# EAGLE design xmosio2 (EAGLE 7.6.0)

## Sheet 1 of 5: BUS i/o
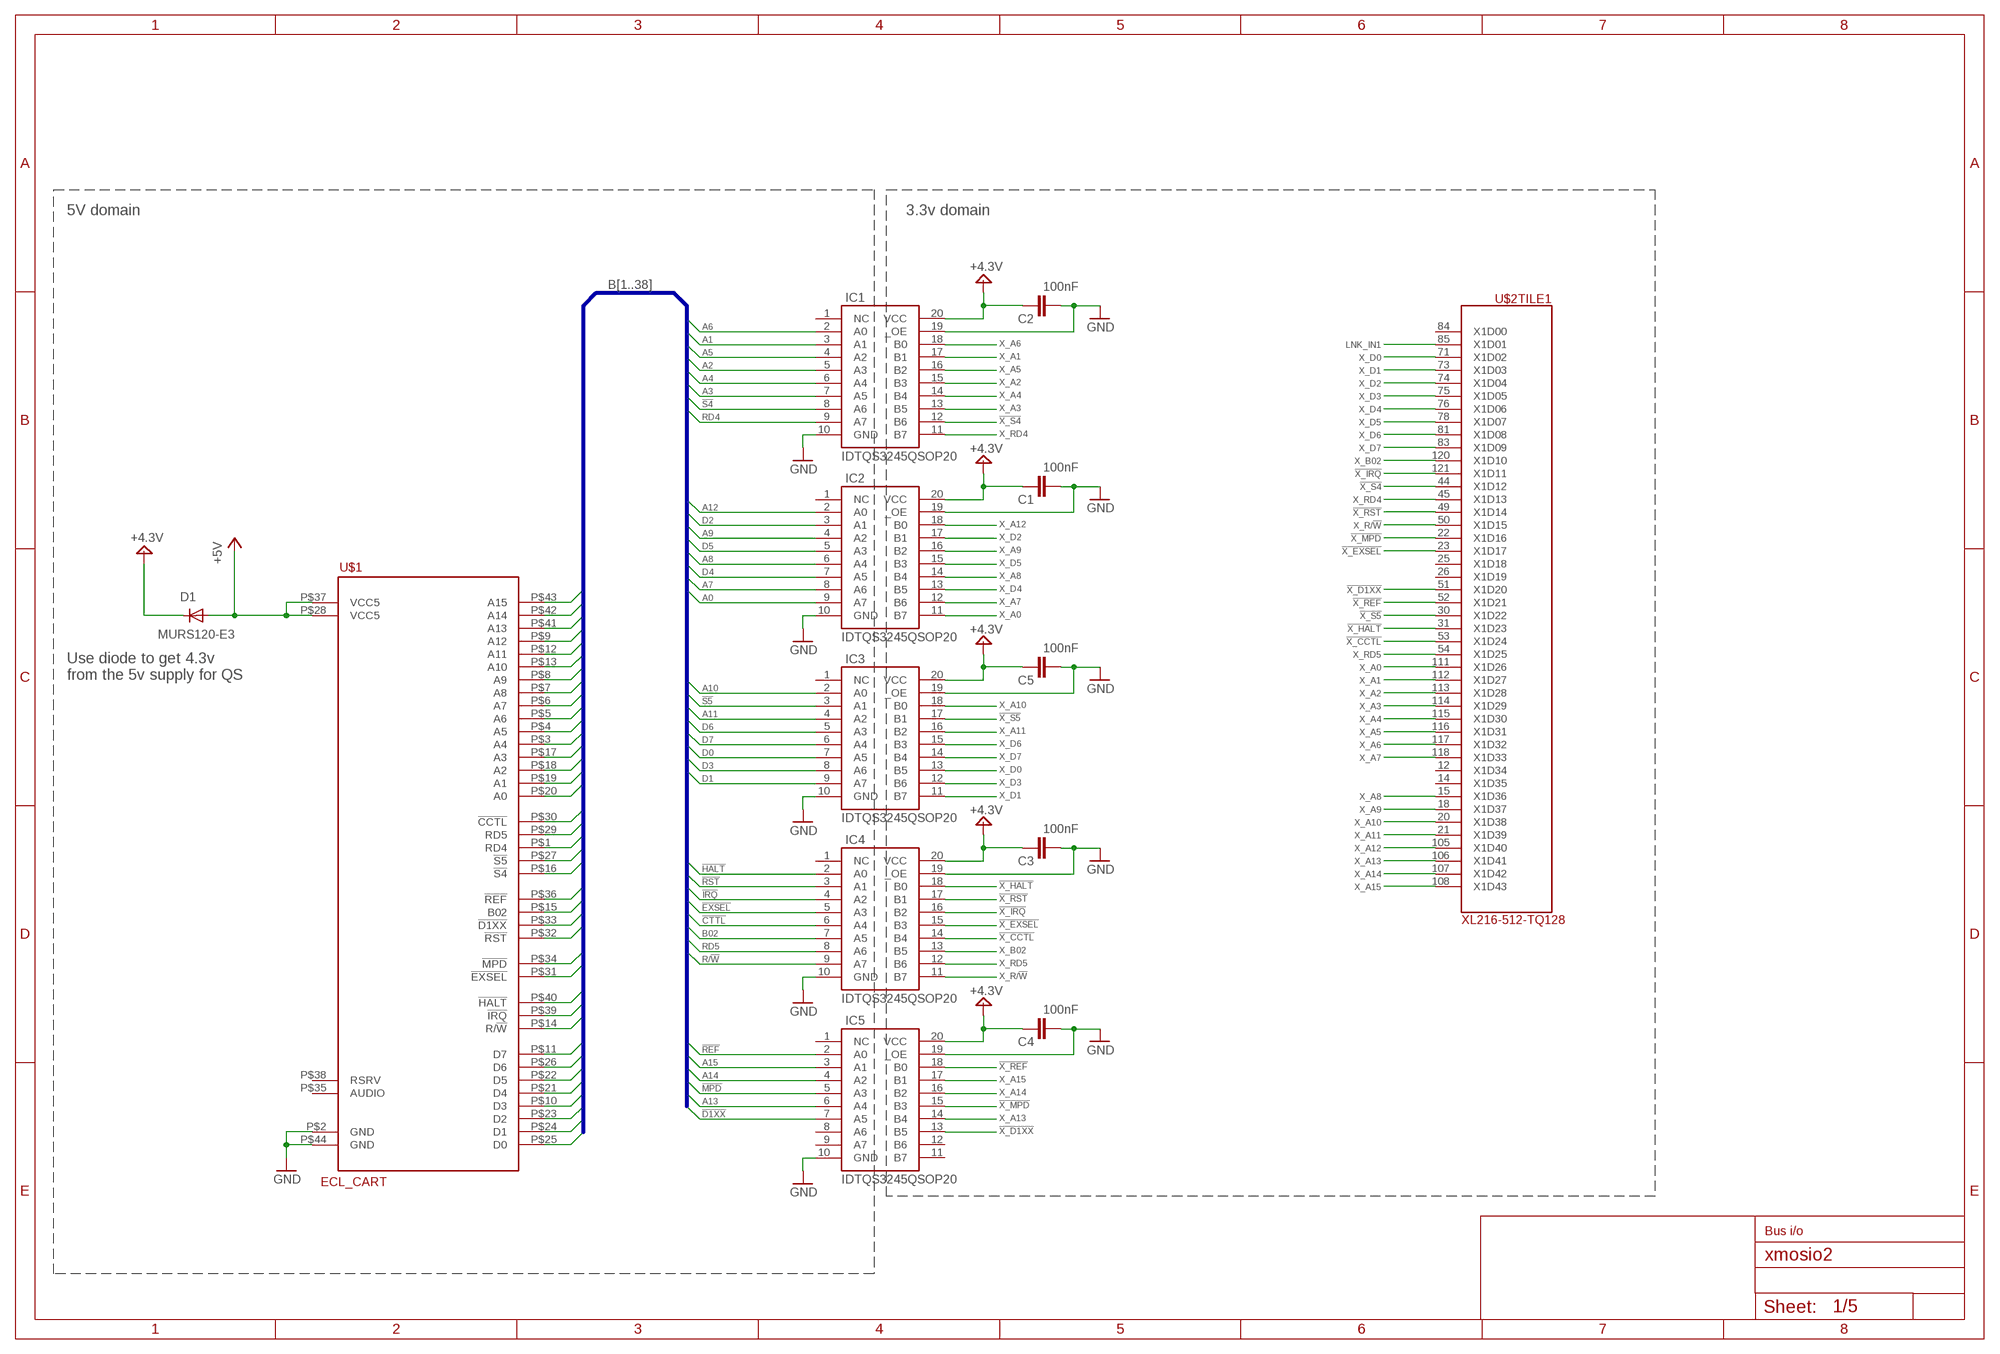
[diagram p0: schematic, sheet 1]

### Parts
C1  100nF  C-EUC0603  [C0603]
C2  100nF  C-EUC0603  [C0603]
C3  100nF  C-EUC0603  [C0603]
C4  100nF  C-EUC0603  [C0603]
C5  100nF  C-EUC0603  [C0603]
D1  MURS120-E3  DIODE-SMB  [SMB]
IC1  IDTQS3245QSOP20  [QSOP20]
IC2  IDTQS3245QSOP20  [QSOP20]
IC3  IDTQS3245QSOP20  [QSOP20]
IC4  IDTQS3245QSOP20  [QSOP20]
IC5  IDTQS3245QSOP20  [QSOP20]
U$1  ECL_CART  [ECL_CART]
U$2  XL216-512-TQ128  [TQFP128]

### Nets
!X_CCTL!: IC4.14(B4) U$2.53(TILE1:X1D24)
!X_D1XX!: IC5.13(B5) U$2.51(TILE1:X1D20)
!X_EXSEL!: IC4.15(B3) U$2.23(TILE1:X1D17)
!X_HALT!: IC4.18(B0) U$2.31(TILE1:X1D23)
!X_IRQ!: IC4.16(B2) U$2.121(TILE1:X1D11)
!X_MPD!: IC5.15(B3) U$2.22(TILE1:X1D16)
!X_REF!: IC5.18(B0) U$2.52(TILE1:X1D21)
!X_RST!: IC4.17(B1) U$2.49(TILE1:X1D14)
!X_S4!: IC1.12(B6) U$2.44(TILE1:X1D12)
!X_S5!: IC3.17(B1) U$2.30(TILE1:X1D22)
+4.3V: C1.1 C2.1 C3.1 C4.1 C5.1 D1.C IC1.20(VCC) IC2.20(VCC) IC3.20(VCC) IC4.20(VCC) IC5.20(VCC)
+5V [Power]: D1.A U$1.P$28(VCC5) U$1.P$37(VCC5) ; also sheet 2
B1: IC1.9(A7) U$1.P$1(RD4)
B2: IC1.8(A6) U$1.P$16(!S4!)
B3: IC1.7(A5) U$1.P$17(A3)
B4: IC1.6(A4) U$1.P$3(A4)
B5: IC1.5(A3) U$1.P$18(A2)
B6: IC1.4(A2) U$1.P$4(A5)
B7: IC1.3(A1) U$1.P$19(A1)
B8: IC1.2(A0) U$1.P$5(A6)
B9: IC2.9(A7) U$1.P$20(A0)
B10: IC2.8(A6) U$1.P$6(A7)
B11: IC2.7(A5) U$1.P$21(D4)
B12: IC2.6(A4) U$1.P$7(A8)
B13: IC2.5(A3) U$1.P$22(D5)
B14: IC2.4(A2) U$1.P$8(A9)
B15: IC2.3(A1) U$1.P$23(D2)
B16: IC2.2(A0) U$1.P$9(A12)
B17: IC3.9(A7) U$1.P$24(D1)
B18: IC3.8(A6) U$1.P$10(D3)
B19: IC3.7(A5) U$1.P$25(D0)
B20: IC3.6(A4) U$1.P$11(D7)
B21: IC3.5(A3) U$1.P$26(D6)
B22: IC3.4(A2) U$1.P$12(A11)
B23: IC3.3(A1) U$1.P$27(!S5!)
B24: IC3.2(A0) U$1.P$13(A10)
B25: IC4.9(A7) U$1.P$14(R/!W!)
B26: IC4.8(A6) U$1.P$29(RD5)
B27: IC4.7(A5) U$1.P$15(B02)
B28: IC4.6(A4) U$1.P$30(!CCTL!)
B29: IC4.5(A3) U$1.P$31(!EXSEL!)
B30: IC4.4(A2) U$1.P$39(!IRQ!)
B31: IC4.3(A1) U$1.P$32(!RST!)
B32: IC4.2(A0) U$1.P$40(!HALT!)
B33: IC5.7(A5) U$1.P$33(!D1XX!)
B34: IC5.6(A4) U$1.P$41(A13)
B35: IC5.5(A3) U$1.P$34(!MPD!)
B36: IC5.4(A2) U$1.P$42(A14)
B37: IC5.3(A1) U$1.P$43(A15)
B38: IC5.2(A0) U$1.P$36(!REF!)
GND: C1.2 C2.2 C3.2 C4.2 C5.2 IC1.10(GND) IC1.19(_OE) IC2.10(GND) IC2.19(_OE) IC3.10(GND) IC3.19(_OE) IC4.10(GND) IC4.19(_OE) IC5.10(GND) IC5.19(_OE) U$1.P$2(GND) U$1.P$44(GND) ; also sheet 2,3,4,5
LNK_IN1: U$2.85(TILE1:X1D01) ; also sheet 5
X_A0: IC2.11(B7) U$2.111(TILE1:X1D26)
X_A1: IC1.17(B1) U$2.112(TILE1:X1D27)
X_A2: IC1.15(B3) U$2.113(TILE1:X1D28)
X_A3: IC1.13(B5) U$2.114(TILE1:X1D29)
X_A4: IC1.14(B4) U$2.115(TILE1:X1D30)
X_A5: IC1.16(B2) U$2.116(TILE1:X1D31)
X_A6: IC1.18(B0) U$2.117(TILE1:X1D32)
X_A7: IC2.12(B6) U$2.118(TILE1:X1D33)
X_A8: IC2.14(B4) U$2.15(TILE1:X1D36)
X_A9: IC2.16(B2) U$2.18(TILE1:X1D37)
X_A10: IC3.18(B0) U$2.20(TILE1:X1D38)
X_A11: IC3.16(B2) U$2.21(TILE1:X1D39)
X_A12: IC2.18(B0) U$2.105(TILE1:X1D40)
X_A13: IC5.14(B4) U$2.106(TILE1:X1D41)
X_A14: IC5.16(B2) U$2.107(TILE1:X1D42)
X_A15: IC5.17(B1) U$2.108(TILE1:X1D43)
X_B02: IC4.13(B5) U$2.120(TILE1:X1D10)
X_D0: IC3.13(B5) U$2.71(TILE1:X1D02)
X_D1: IC3.11(B7) U$2.73(TILE1:X1D03)
X_D2: IC2.17(B1) U$2.74(TILE1:X1D04)
X_D3: IC3.12(B6) U$2.75(TILE1:X1D05)
X_D4: IC2.13(B5) U$2.76(TILE1:X1D06)
X_D5: IC2.15(B3) U$2.78(TILE1:X1D07)
X_D6: IC3.15(B3) U$2.81(TILE1:X1D08)
X_D7: IC3.14(B4) U$2.83(TILE1:X1D09)
X_R/!W!: IC4.11(B7) U$2.50(TILE1:X1D15)
X_RD4: IC1.11(B7) U$2.45(TILE1:X1D13)
X_RD5: IC4.12(B6) U$2.54(TILE1:X1D25)
Unconnected: IC1.1(NC) IC2.1(NC) IC3.1(NC) IC4.1(NC) IC5.1(NC) IC5.8(A6) IC5.9(A7) IC5.11(B7) IC5.12(B6) U$1.P$35(AUDIO) U$1.P$38(RSRV) U$2.12(TILE1:X1D34) U$2.14(TILE1:X1D35) U$2.25(TILE1:X1D18) U$2.26(TILE1:X1D19) U$2.84(TILE1:X1D00)

### Buses
B[1..38]

### Notes on the sheet
- 5V domain | 3.3v domain
- A6
- A1
- A5
- A2
- A4
- A3
- !S4!
- RD4
- A12
- D2
- A9
- D5
- A8
- D4
- A7
- A0
- Use diode to get 4.3v
  from the 5v supply for QS
- A10
- !S5!
- A11
- D6
- D7
- D0
- D3
- D1
- !HALT!
- !RST!
- !IRQ!
- !EXSEL!
- !CTTL!
- B02
- RD5
- R/!W!
- !REF!
- A15
- A14
- !MPD!
- A13
- !D1XX!
- Bus i/o

## Sheet 2 of 5: Power
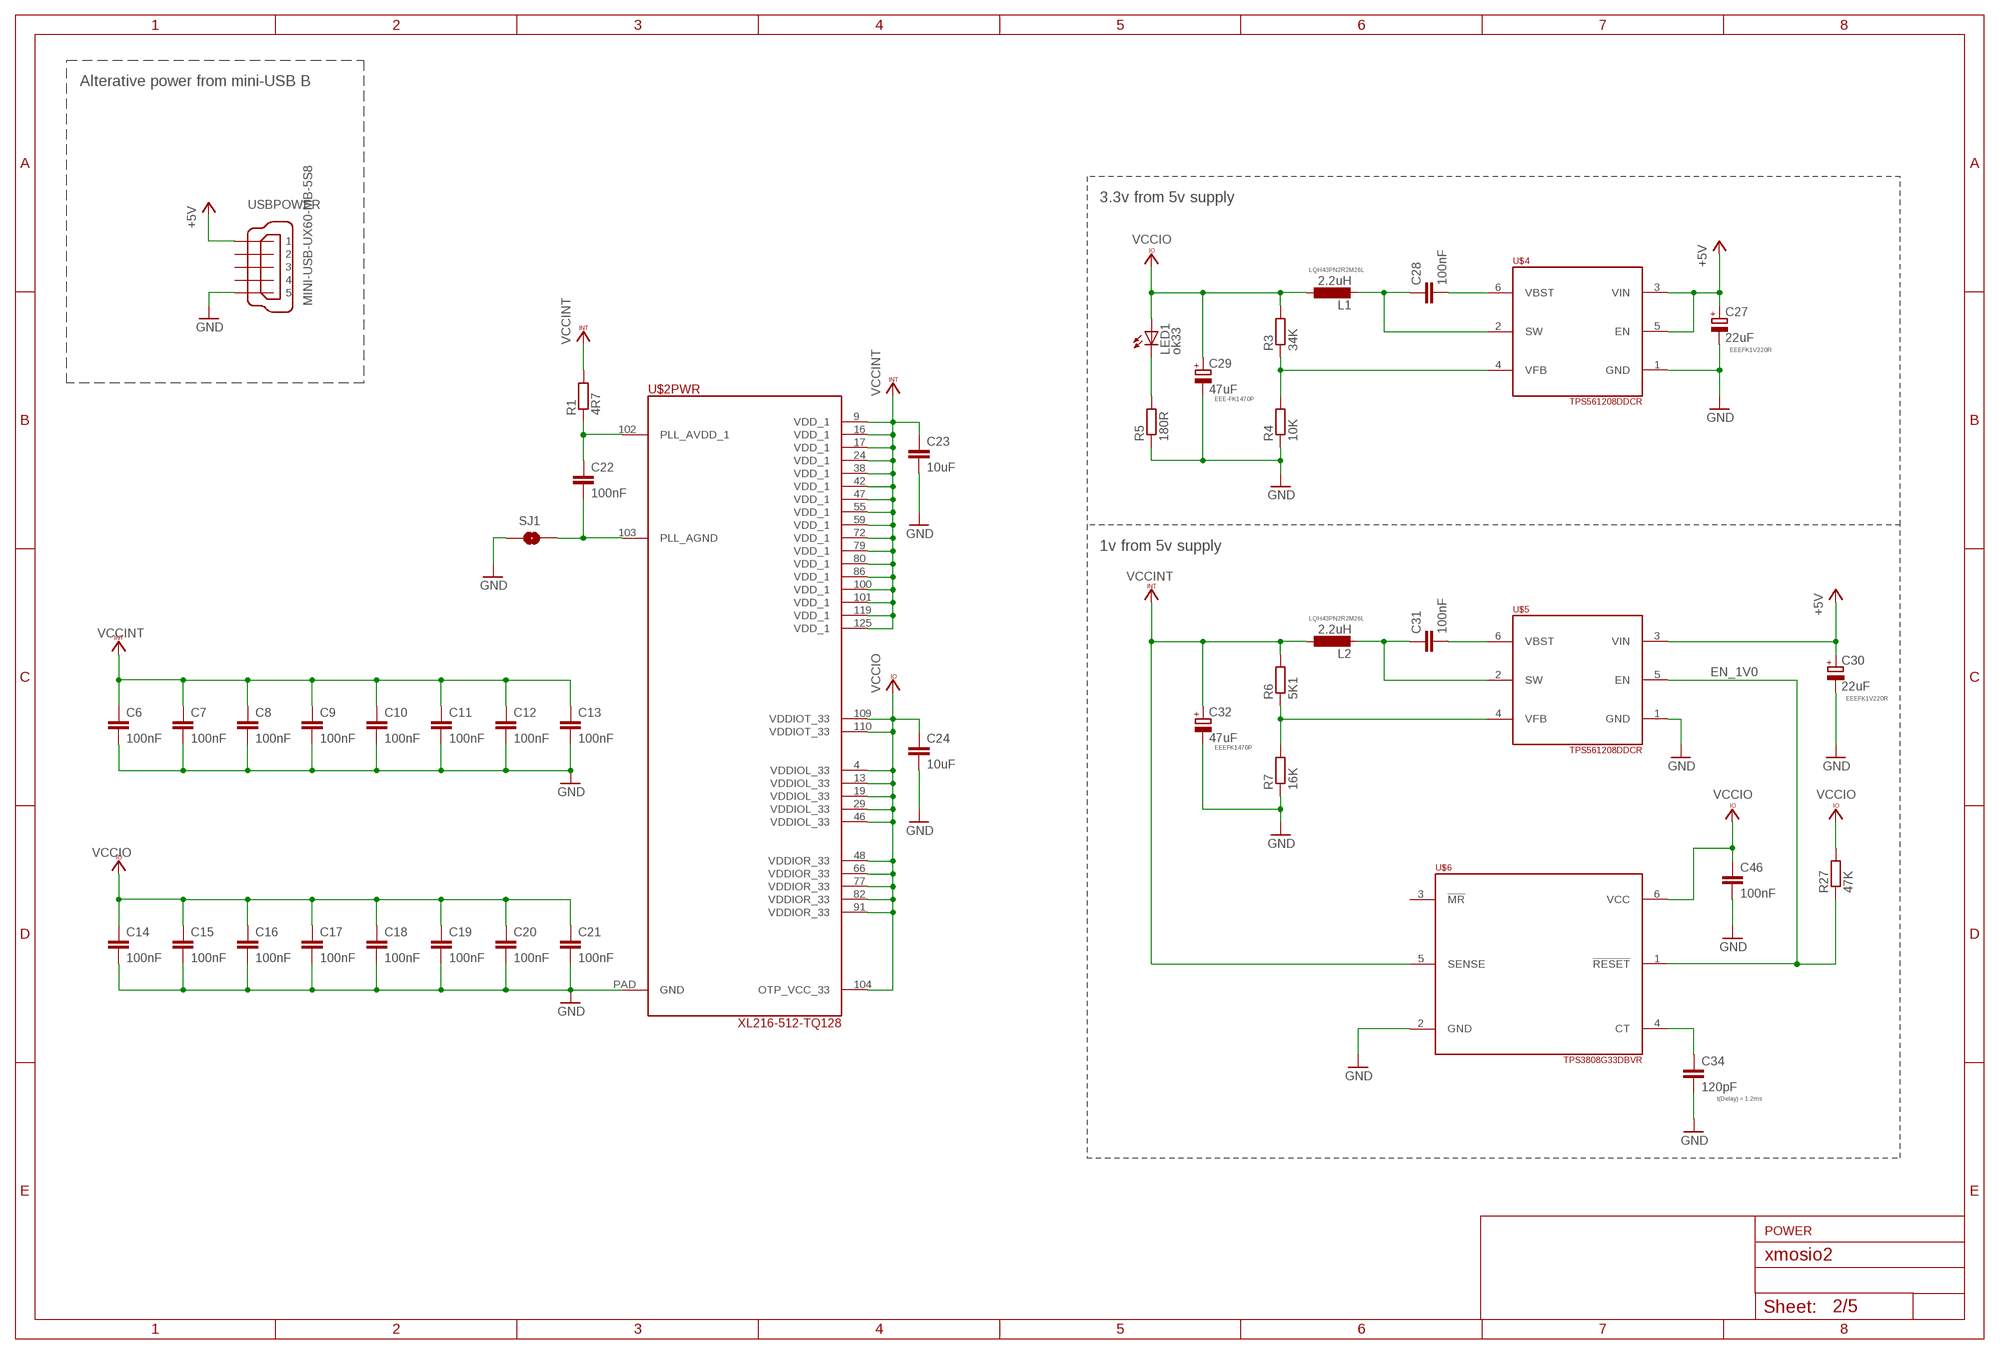
[diagram p1: schematic, sheet 2]

### Parts
C6  100nF  C-EUC0603  [C0603]
C7  100nF  C-EUC0603  [C0603]
C8  100nF  C-EUC0603  [C0603]
C9  100nF  C-EUC0603  [C0603]
C10  100nF  C-EUC0603  [C0603]
C11  100nF  C-EUC0603  [C0603]
C12  100nF  C-EUC0603  [C0603]
C13  100nF  C-EUC0603  [C0603]
C14  100nF  C-EUC0603  [C0603]
C15  100nF  C-EUC0603  [C0603]
C16  100nF  C-EUC0603  [C0603]
C17  100nF  C-EUC0603  [C0603]
C18  100nF  C-EUC0603  [C0603]
C19  100nF  C-EUC0603  [C0603]
C20  100nF  C-EUC0603  [C0603]
C21  100nF  C-EUC0603  [C0603]
C22  100nF  C-EUC0603  [C0603]
C23  10uF  C-EUC0603  [C0603]
C24  10uF  C-EUC0603  [C0603]
C27  22uF  CPOL-EUC  [PANASONIC_C]
C28  100nF  C-EUC0603  [C0603]
C29  47uF  CPOL-EUD  [PANASONIC_D]
C30  22uF  CPOL-EUC  [PANASONIC_C]
C31  100nF  C-EUC0603  [C0603]
C32  47uF  CPOL-EUD  [PANASONIC_D]
C34  120pF  C-EUC0603  [C0603]
C46  100nF  C-EUC0603  [C0603]
L1  2.2uH  L-EUL1812  [L1812]
L2  2.2uH  L-EUL1812  [L1812]
LED1  ok33  LEDCHIP-LED0805  [CHIP-LED0805]
R1  4R7  R-EU_R0603  [R0603]
R3  34K  R-EU_R0603  [R0603]
R4  10K  R-EU_R0603  [R0603]
R5  180R  R-EU_R0603  [R0603]
R6  5K1  R-EU_R0603  [R0603]
R7  16K  R-EU_R0603  [R0603]
R27  47K  R-EU_R0603  [R0603]
SJ1  SOLDERJUMPERNC  [SJ_2S]
U$4  TPS561208DDCR  [TSOT23-6_DDC]
U$5  TPS561208DDCR  [TSOT23-6_DDC]
U$6  TPS3808G33DBVR  [SOT23-6]
USBPOWER  MINI-USB-UX60-MB-5S8  [UX60-MB-5S8]

### Nets
+5V [Power]: C27.+ C30.+ U$4.3(VIN) U$4.5(EN) U$5.3(VIN) USBPOWER.1 ; also sheet 1
EN_1V0 [Power]: R27.1 U$5.5(EN) U$6.1(!RESET!)
GND: C6.2 C7.2 C8.2 C9.2 C10.2 C11.2 C12.2 C13.2 C14.2 C15.2 C16.2 C17.2 C18.2 C19.2 C20.2 C21.2 C23.2 C24.2 C27.- C29.- C30.- C32.- C34.2 C46.2 R4.1 R5.1 R7.1 SJ1.1 U$2.PAD(PWR:GND) U$4.1(GND) U$5.1(GND) U$6.2(GND) USBPOWER.5 ; also sheet 1,3,4,5
N$1: C22.1 R1.1 U$2.102(PWR:PLL_AVDD_1)
N$3: C22.2 SJ1.2 U$2.103(PWR:PLL_AGND)
N$4: C28.2 U$4.6(VBST)
N$7 [Power]: C28.1 L1.2 U$4.2(SW)
N$8 [Power]: C31.2 U$5.6(VBST)
N$9 [Power]: R3.1 R4.2 U$4.4(VFB)
N$10: LED1.C R5.2
N$11 [Power]: C31.1 L2.2 U$5.2(SW)
N$12 [Power]: R6.1 R7.2 U$5.4(VFB)
N$13 [Power]: C34.1 U$6.4(CT)
VCCINT: C6.1 C7.1 C8.1 C9.1 C10.1 C11.1 C12.1 C13.1 C23.1 C32.+ L2.1 R1.2 R6.2 U$2.9(PWR:VDD_1) U$2.16(PWR:VDD_1) U$2.17(PWR:VDD_1) U$2.24(PWR:VDD_1) U$2.38(PWR:VDD_1) U$2.42(PWR:VDD_1) U$2.47(PWR:VDD_1) U$2.55(PWR:VDD_1) U$2.59(PWR:VDD_1) U$2.72(PWR:VDD_1) U$2.79(PWR:VDD_1) U$2.80(PWR:VDD_1) U$2.86(PWR:VDD_1) U$2.100(PWR:VDD_1) U$2.101(PWR:VDD_1) U$2.119(PWR:VDD_1) U$2.125(PWR:VDD_1) U$6.5(SENSE) ; also sheet 4
VCCIO: C14.1 C15.1 C16.1 C17.1 C18.1 C19.1 C20.1 C21.1 C24.1 C29.+ C46.1 L1.1 LED1.A R3.2 R27.2 U$2.4(PWR:VDDIOL_33) U$2.13(PWR:VDDIOL_33) U$2.19(PWR:VDDIOL_33) U$2.29(PWR:VDDIOL_33) U$2.46(PWR:VDDIOL_33) U$2.48(PWR:VDDIOR_33) U$2.66(PWR:VDDIOR_33) U$2.77(PWR:VDDIOR_33) U$2.82(PWR:VDDIOR_33) U$2.91(PWR:VDDIOR_33) U$2.104(PWR:OTP_VCC_33) U$2.109(PWR:VDDIOT_33) U$2.110(PWR:VDDIOT_33) U$6.6(VCC) ; also sheet 3,4,5
Unconnected: U$6.3(!MR!) USBPOWER.2 USBPOWER.3 USBPOWER.4

### Notes on the sheet
- Alterative power from mini-USB B
- 3.3v from 5v supply
- LQH43PN2R2M26L
- EEEFK1V220R
- EEE-FK1470P
- 1v from 5v supply
- LQH43PN2R2M26L
- EEEFK1V220R
- EEEFK1470P
- t(Delay) = 1.2ms
- POWER

## Sheet 3 of 5: SDRAM / QSPI
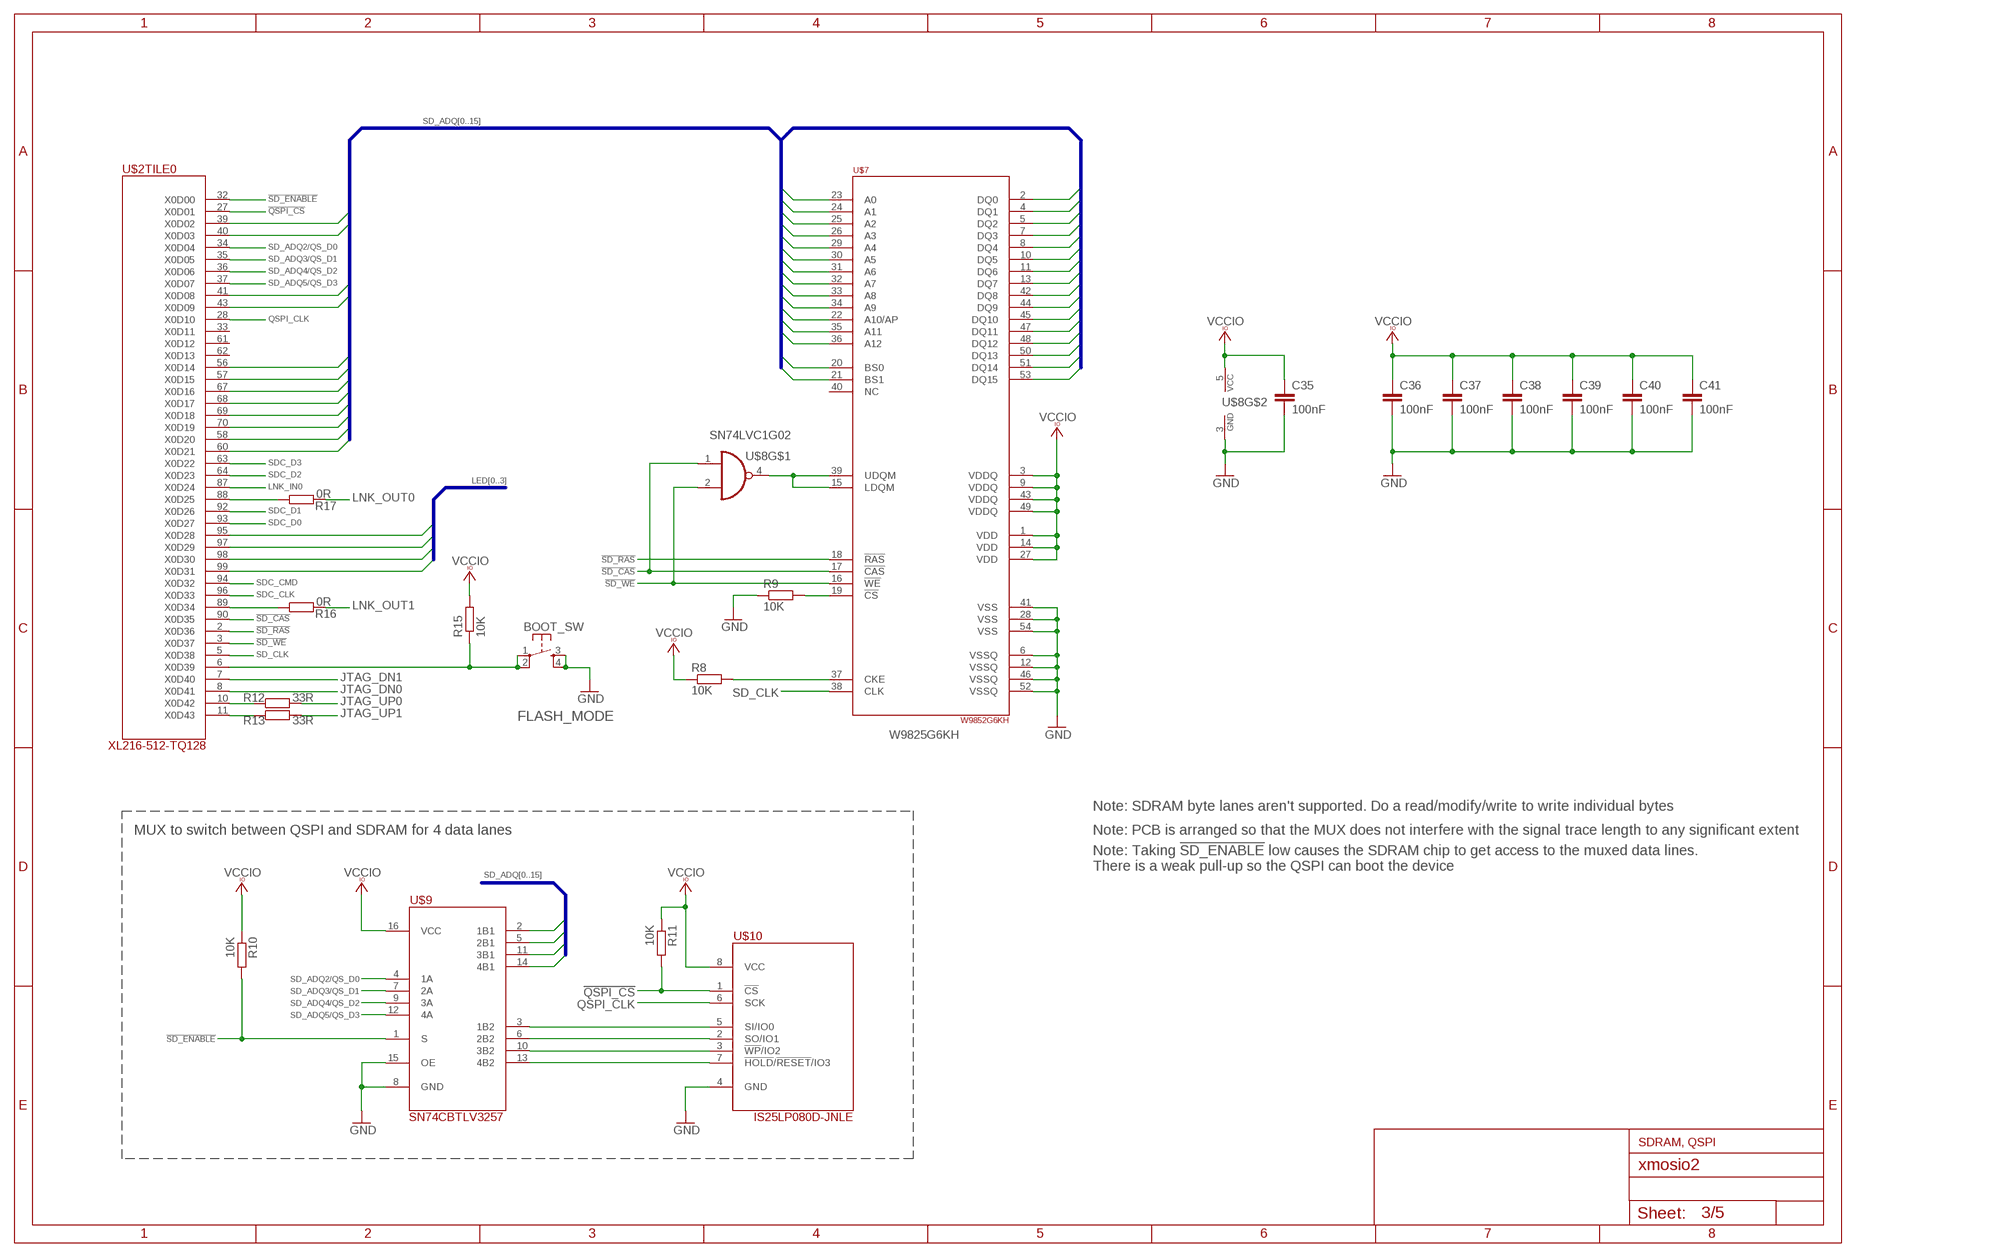
[diagram p2: schematic, sheet 3]

### Parts
BOOT_SW  FLASH_MODE  TAC_SWITCHPTH  [TACTILE-PTH]
C35  100nF  C-EUC0603  [C0603]
C36  100nF  C-EUC0603  [C0603]
C37  100nF  C-EUC0603  [C0603]
C38  100nF  C-EUC0603  [C0603]
C39  100nF  C-EUC0603  [C0603]
C40  100nF  C-EUC0603  [C0603]
C41  100nF  C-EUC0603  [C0603]
R8  10K  R-EU_R0603  [R0603]
R9  10K  R-EU_R0603  [R0603]
R10  10K  R-EU_R0603  [R0603]
R11  10K  R-EU_R0603  [R0603]
R12  33R  R-EU_R0603  [R0603]
R13  33R  R-EU_R0603  [R0603]
R15  10K  R-EU_R0603  [R0603]
R16  0R  R-EU_R0603  [R0603]
R17  0R  R-EU_R0603  [R0603]
U$7  W9852G6KH  [TSOP54-400]
U$8  SN74LVC1G02  [SOT23-5]
U$9  SN74CBTLV3257  [SO16]
U$10  IS25LP080D-JNLE  [SO-08]

### Nets
!QSPI_CS!: R11.2 U$2.27(TILE0:X0D01) U$10.1(!CS!)
!SD_CAS!: U$2.90(TILE0:X0D35) U$7.17(!CAS!) U$8.1(I0)
!SD_ENABLE!: R10.2 U$2.32(TILE0:X0D00) U$9.1(S)
!SD_RAS!: U$2.2(TILE0:X0D36) U$7.18(!RAS!)
!SD_WE!: U$2.3(TILE0:X0D37) U$7.16(!WE!) U$8.2(I1)
GND: BOOT_SW.3 BOOT_SW.4 C35.2 C36.2 C37.2 C38.2 C39.2 C40.2 C41.2 R9.1 U$7.6(VSSQ) U$7.12(VSSQ) U$7.28(VSS) U$7.41(VSS) U$7.46(VSSQ) U$7.52(VSSQ) U$7.54(VSS) U$8.3(GND) U$9.8(GND) U$9.15(OE) U$10.4(GND) ; also sheet 1,2,4,5
JTAG_DN0: U$2.8(TILE0:X0D41) ; also sheet 4
JTAG_DN1: U$2.7(TILE0:X0D40) ; also sheet 4
JTAG_UP0: R12.2 ; also sheet 4
JTAG_UP1: R13.2 ; also sheet 4
LED0: U$2.95(TILE0:X0D28) ; also sheet 5
LED1: U$2.97(TILE0:X0D29) ; also sheet 5
LED2: U$2.98(TILE0:X0D30) ; also sheet 5
LED3: U$2.99(TILE0:X0D31) ; also sheet 5
LNK_IN0: U$2.87(TILE0:X0D24) ; also sheet 5
LNK_OUT0: R17.2 ; also sheet 5
LNK_OUT1: R16.2 ; also sheet 5
N$14: U$7.15(LDQM) U$7.39(UDQM) U$8.4(O)
N$15: R8.2 U$7.37(CKE)
N$16: U$9.3(1B2) U$10.5(SI/IO0)
N$17: R9.2 U$7.19(!CS!)
N$18: U$9.6(2B2) U$10.2(SO/IO1)
N$19: U$9.10(3B2) U$10.3(!WP!/IO2)
N$20: U$9.13(4B2) U$10.7(!HOLD!/!RESET!/IO3)
N$22: R12.1 U$2.10(TILE0:X0D42)
N$23: R13.1 U$2.11(TILE0:X0D43)
N$28: R17.1 U$2.88(TILE0:X0D25)
N$29: R16.1 U$2.89(TILE0:X0D34)
N$33: BOOT_SW.1 BOOT_SW.2 R15.1 U$2.6(TILE0:X0D39)
QSPI_CLK: U$2.28(TILE0:X0D10) U$10.6(SCK)
SD_ADQ0: U$2.39(TILE0:X0D02) U$7.2(DQ0) U$7.23(A0)
SD_ADQ1: U$2.40(TILE0:X0D03) U$7.4(DQ1) U$7.24(A1)
SD_ADQ2: U$7.5(DQ2) U$7.25(A2) U$9.2(1B1)
SD_ADQ2/QS_D0: U$2.34(TILE0:X0D04) U$9.4(1A)
SD_ADQ3: U$7.7(DQ3) U$7.26(A3) U$9.5(2B1)
SD_ADQ3/QS_D1: U$2.35(TILE0:X0D05) U$9.7(2A)
SD_ADQ4: U$7.8(DQ4) U$7.29(A4) U$9.11(3B1)
SD_ADQ4/QS_D2: U$2.36(TILE0:X0D06) U$9.9(3A)
SD_ADQ5: U$7.10(DQ5) U$7.30(A5) U$9.14(4B1)
SD_ADQ5/QS_D3: U$2.37(TILE0:X0D07) U$9.12(4A)
SD_ADQ6: U$2.41(TILE0:X0D08) U$7.11(DQ6) U$7.31(A6)
SD_ADQ7: U$2.43(TILE0:X0D09) U$7.13(DQ7) U$7.32(A7)
SD_ADQ8: U$2.56(TILE0:X0D14) U$7.33(A8) U$7.42(DQ8)
SD_ADQ9: U$2.57(TILE0:X0D15) U$7.34(A9) U$7.44(DQ9)
SD_ADQ10: U$2.67(TILE0:X0D16) U$7.22(A10/AP) U$7.45(DQ10)
SD_ADQ11: U$2.68(TILE0:X0D17) U$7.35(A11) U$7.47(DQ11)
SD_ADQ12: U$2.69(TILE0:X0D18) U$7.36(A12) U$7.48(DQ12)
SD_ADQ13: U$2.70(TILE0:X0D19) U$7.20(BS0) U$7.50(DQ13)
SD_ADQ14: U$2.58(TILE0:X0D20) U$7.21(BS1) U$7.51(DQ14)
SD_ADQ15: U$2.60(TILE0:X0D21) U$7.53(DQ15)
SD_CLK: U$2.5(TILE0:X0D38) U$7.38(CLK)
SDC_CLK: U$2.96(TILE0:X0D33) ; also sheet 5
SDC_CMD: U$2.94(TILE0:X0D32) ; also sheet 5
SDC_D0: U$2.93(TILE0:X0D27) ; also sheet 5
SDC_D1: U$2.92(TILE0:X0D26) ; also sheet 5
SDC_D2: U$2.64(TILE0:X0D23) ; also sheet 5
SDC_D3: U$2.63(TILE0:X0D22) ; also sheet 5
VCCIO: C35.1 C36.1 C37.1 C38.1 C39.1 C40.1 C41.1 R8.1 R10.1 R11.1 R15.2 U$7.1(VDD) U$7.3(VDDQ) U$7.9(VDDQ) U$7.14(VDD) U$7.27(VDD) U$7.43(VDDQ) U$7.49(VDDQ) U$8.5(VCC) U$9.16(VCC) U$10.8(VCC) ; also sheet 2,4,5
Unconnected: U$2.33(TILE0:X0D11) U$2.61(TILE0:X0D12) U$2.62(TILE0:X0D13) U$7.40(NC)

### Buses
SD_ADQ[0..15]
LED[0..3]

### Notes on the sheet
- W9825G6KH
- Note: SDRAM byte lanes aren't supported. Do a read/modify/write to write individual bytes
- MUX to switch between QSPI and SDRAM for 4 data lanes | Note: PCB is arranged so that the MUX does not interfere with the signal trace length to any significant extent
- Note: Taking !SD_ENABLE! low causes the SDRAM chip to get access to the muxed data lines.
  There is a weak pull-up so the QSPI can boot the device
- SDRAM, QSPI

## Sheet 4 of 5: Clock/JTAG
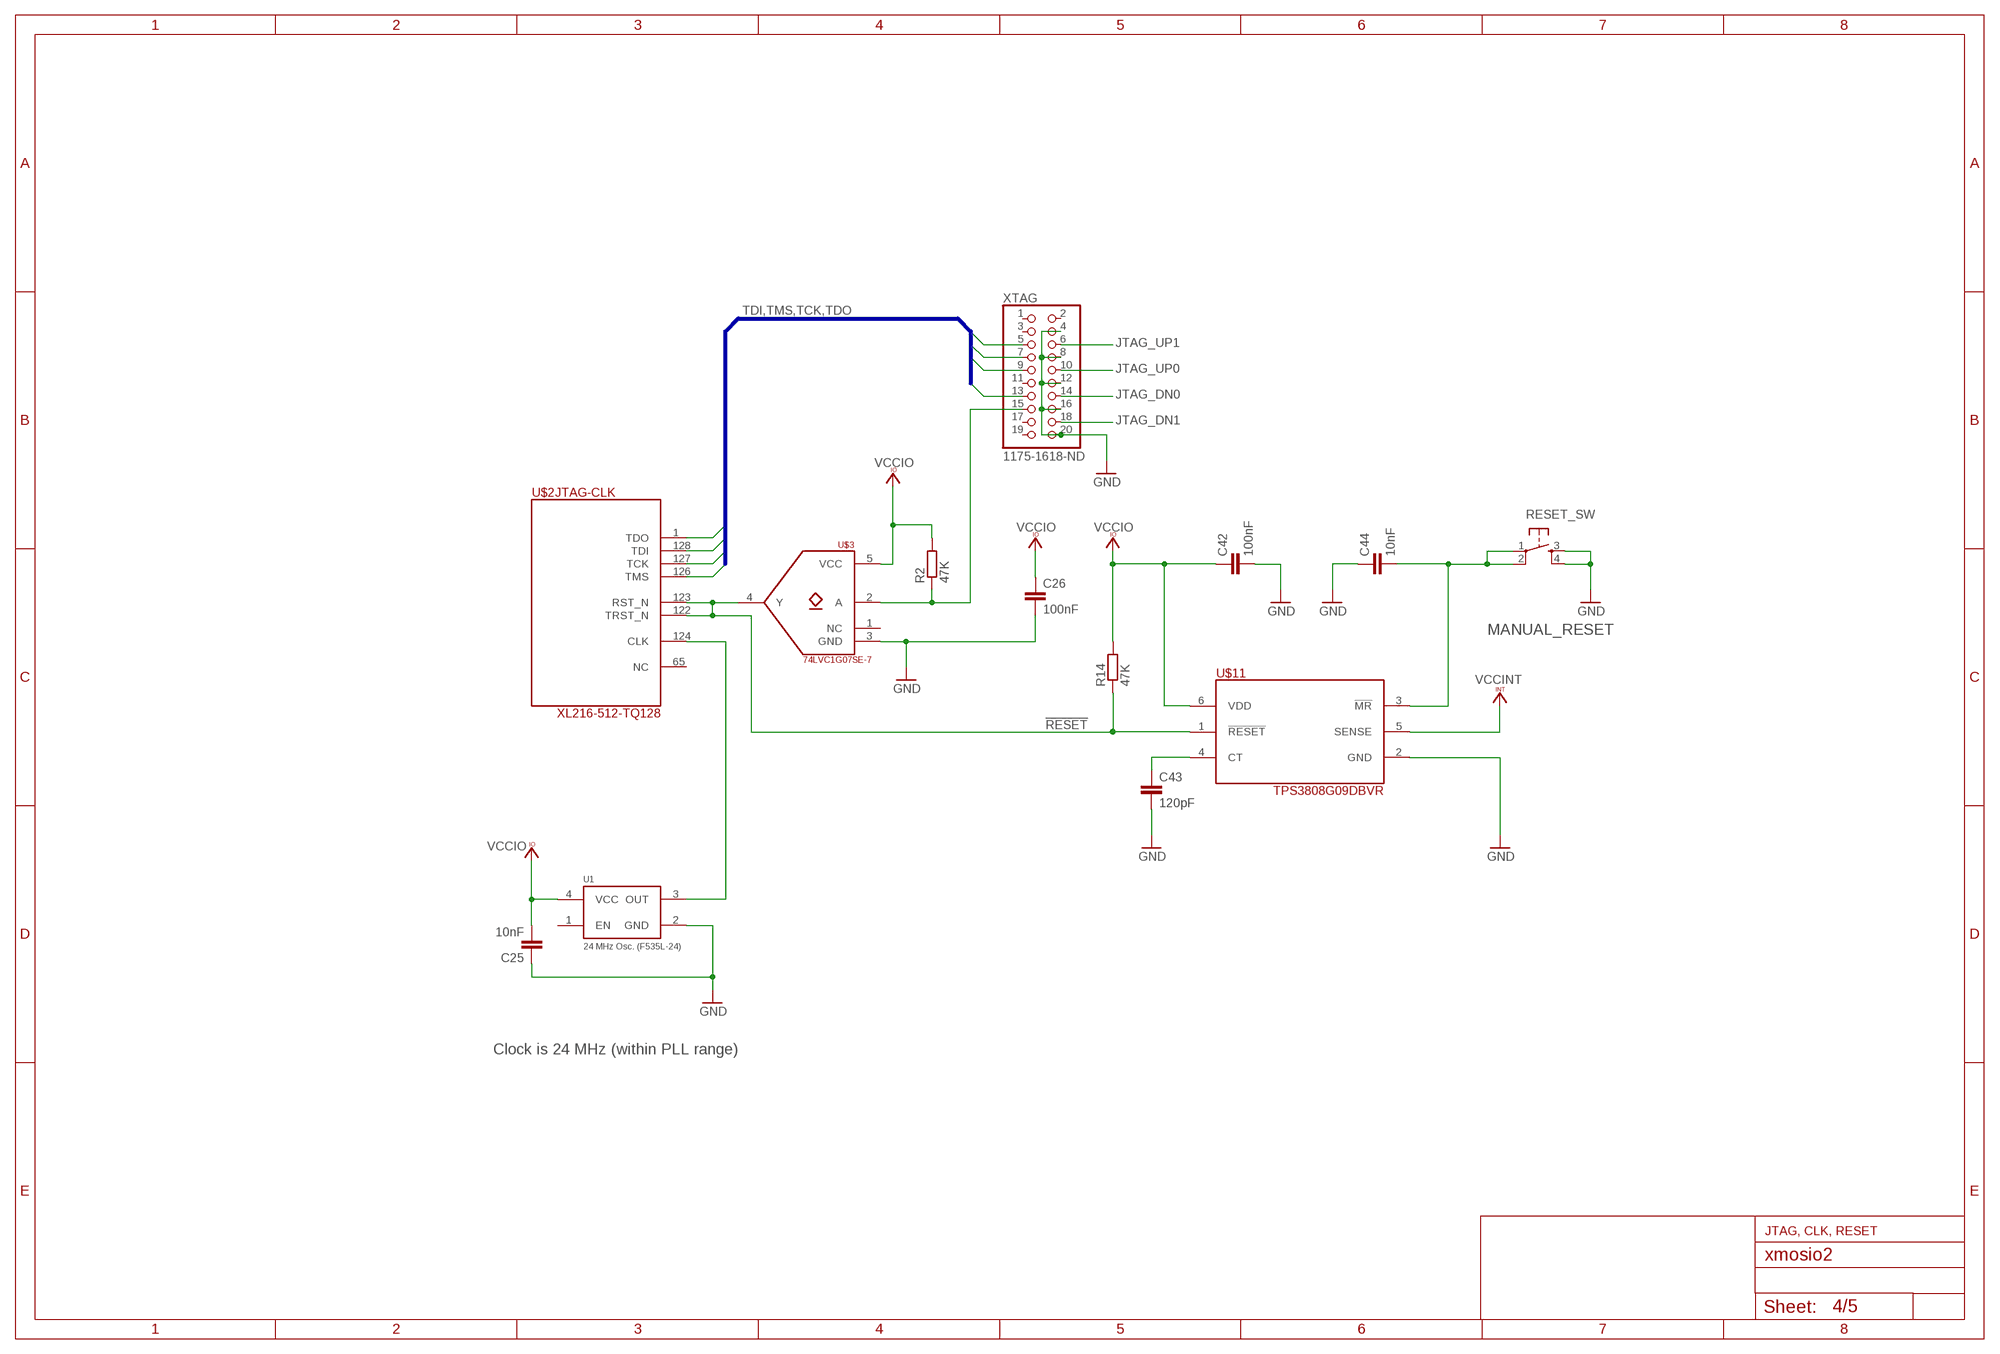
[diagram p3: schematic, sheet 4]

### Parts
C25  10nF  C-EUC0603  [C0603]
C26  100nF  C-EUC0603  [C0603]
C42  100nF  C-EUC0603  [C0603]
C43  120pF  C-EUC0603  [C0603]
C44  10nF  C-EUC0603  [C0603]
R2  47K  R-EU_R0603  [R0603]
R14  47K  R-EU_R0603  [R0603]
RESET_SW  MANUAL_RESET  TAC_SWITCHPTH  [TACTILE-PTH]
U1  24 MHz Osc. (F535L-24)  OSCILLATOR5X3-PIN1-INDICATED  [CRYSTAL-OSC-SMD-5X3]
U$3  74LVC1G07SE-7  [SOT23-5]
U$11  TPS3808G09DBVR  [SOT23-6]
XTAG  1175-1618-ND  PINHD-2X10/90  [2X10/90]

### Nets
!RESET!: R14.1 U$2.122(JTAG-CLK:TRST_N) U$2.123(JTAG-CLK:RST_N) U$3.4(Y) U$11.1(!RESET!)
GND: C25.1 C26.2 C42.2 C43.2 C44.1 RESET_SW.3 RESET_SW.4 U1.2(GND) U$3.3(GND) U$11.2(GND) XTAG.4 XTAG.8 XTAG.12 XTAG.16 XTAG.20 ; also sheet 1,2,3,5
JTAG_DN0: XTAG.14 ; also sheet 3
JTAG_DN1: XTAG.18 ; also sheet 3
JTAG_UP0: XTAG.10 ; also sheet 3
JTAG_UP1: XTAG.6 ; also sheet 3
N$2: U1.3(OUT) U$2.124(JTAG-CLK:CLK)
N$5: R2.1 U$3.2(A) XTAG.15
N$6: C43.1 U$11.4(CT)
N$21: C44.2 RESET_SW.1 RESET_SW.2 U$11.3(!MR!)
TCK: U$2.127(JTAG-CLK:TCK) XTAG.9
TDI: U$2.128(JTAG-CLK:TDI) XTAG.5
TDO: U$2.1(JTAG-CLK:TDO) XTAG.13
TMS: U$2.126(JTAG-CLK:TMS) XTAG.7
VCCINT: U$11.5(SENSE) ; also sheet 2
VCCIO: C25.2 C26.1 C42.1 R2.2 R14.2 U1.4(VCC) U$3.5(VCC) U$11.6(VDD) ; also sheet 2,3,5
Unconnected: U1.1(EN) U$2.65(JTAG-CLK:NC) U$3.1(NC) XTAG.1 XTAG.2 XTAG.3 XTAG.11 XTAG.17 XTAG.19

### Buses
TDI,TMS,TCK,TDO

### Notes on the sheet
- Clock is 24 MHz (within PLL range)
- JTAG, CLK, RESET

## Sheet 5 of 5: HS Link
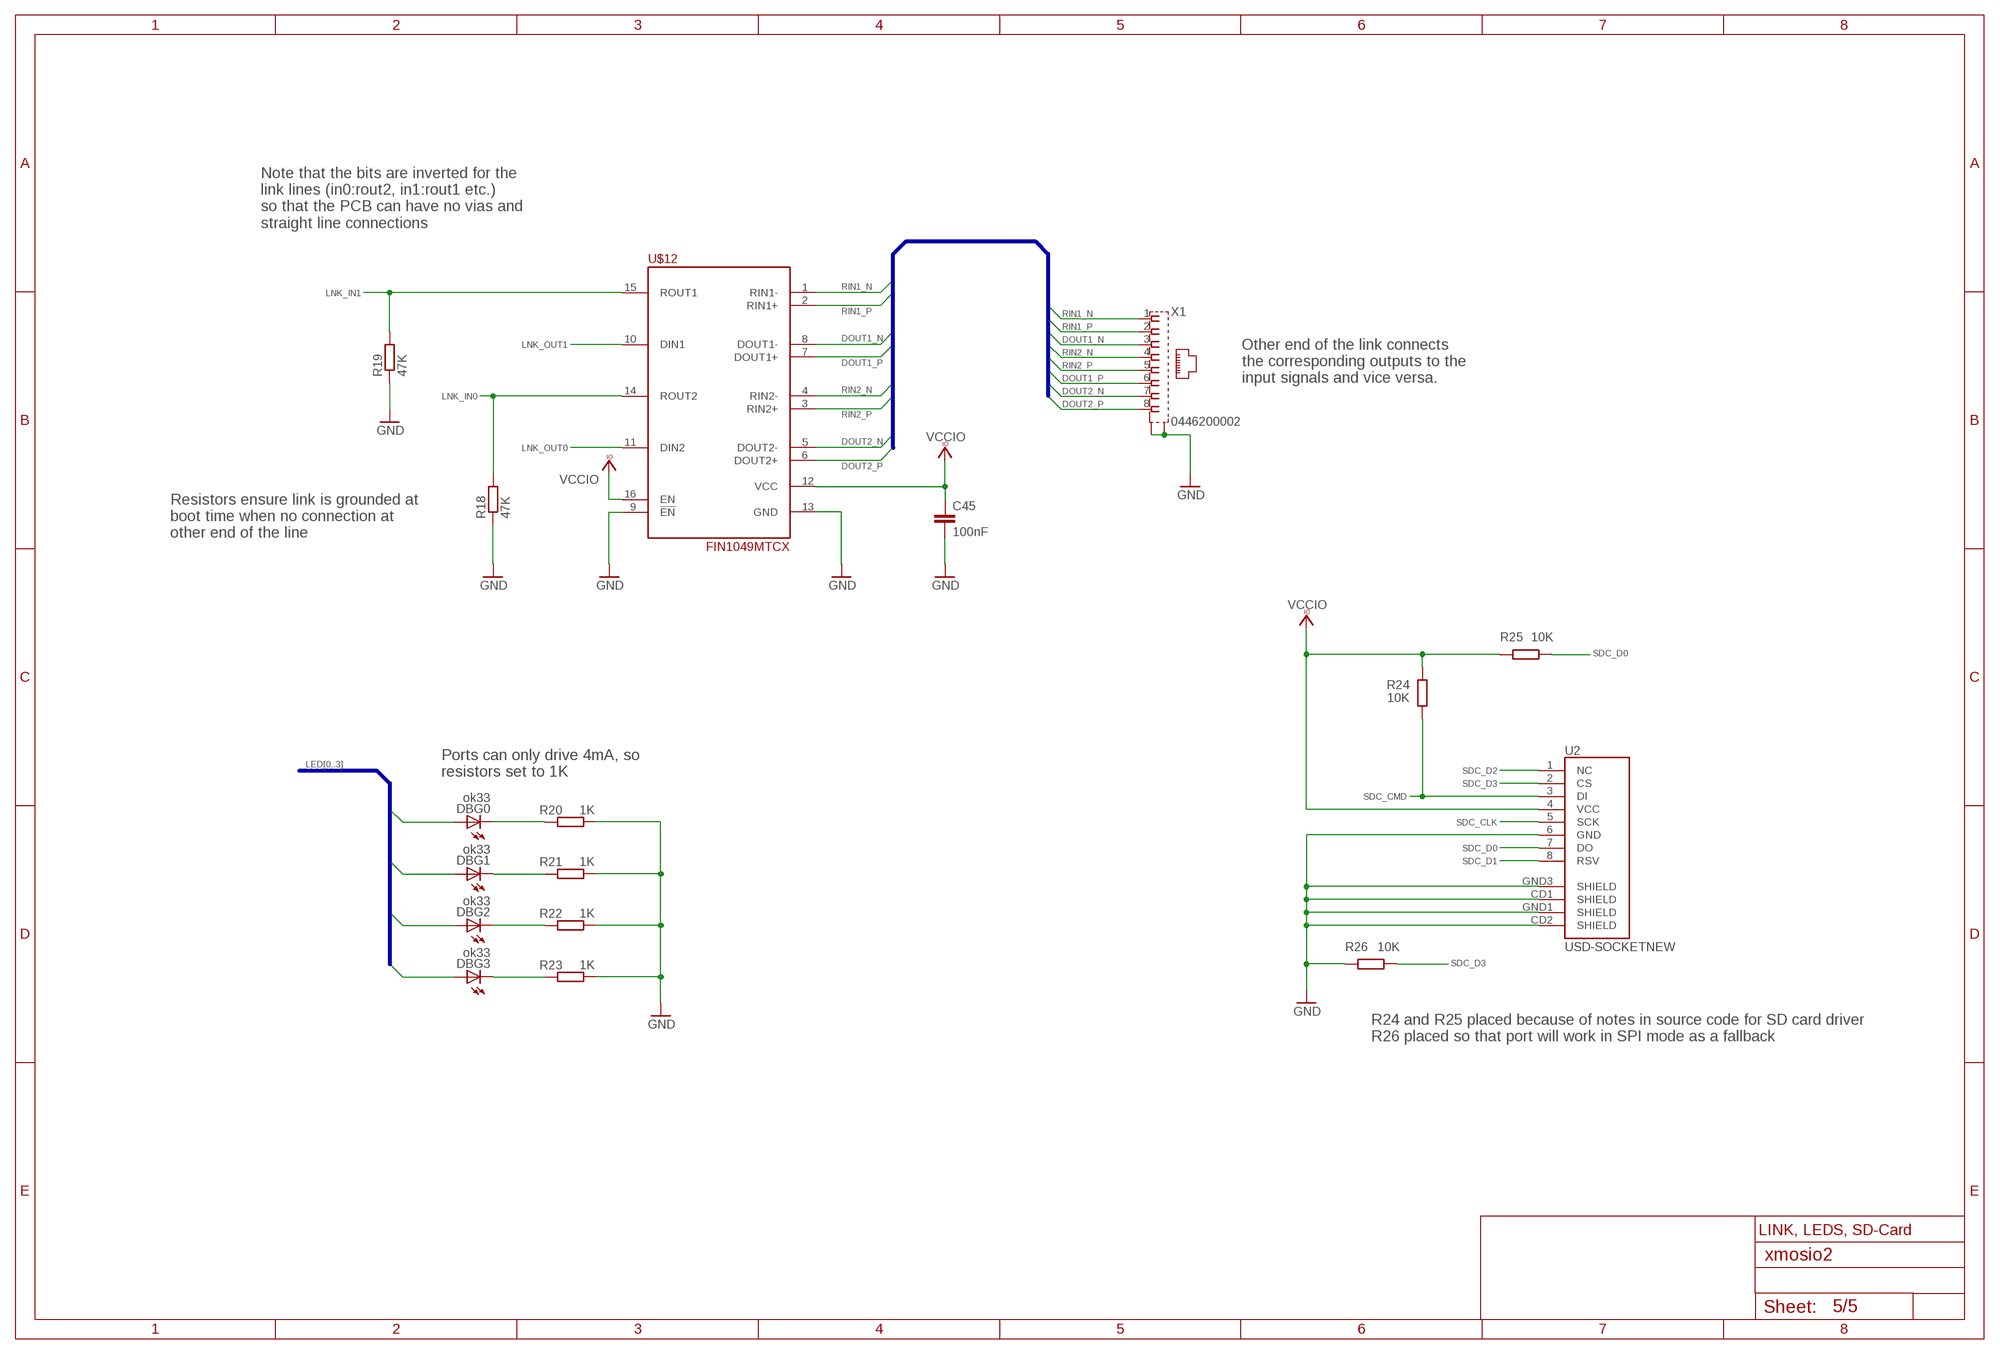
[diagram p4: schematic, sheet 5]

### Parts
C45  100nF  C-EUC0603  [C0603]
DBG0  ok33  LEDCHIP-LED0805  [CHIP-LED0805]
DBG1  ok33  LEDCHIP-LED0805  [CHIP-LED0805]
DBG2  ok33  LEDCHIP-LED0805  [CHIP-LED0805]
DBG3  ok33  LEDCHIP-LED0805  [CHIP-LED0805]
R18  47K  R-EU_R0603  [R0603]
R19  47K  R-EU_R0603  [R0603]
R20  1K  R-EU_R0603  [R0603]
R21  1K  R-EU_R0603  [R0603]
R22  1K  R-EU_R0603  [R0603]
R23  1K  R-EU_R0603  [R0603]
R24  10K  R-EU_R0603  [R0603]
R25  10K  R-EU_R0603  [R0603]
R26  10K  R-EU_R0603  [R0603]
U2  USD-SOCKETNEW  [MICRO-SD-SOCKET-PP]
U$12  FIN1049MTCX  [TSSOP16]
X1  0446200002  [0446200002]

### Nets
DOUT1_N: U$12.8(DOUT1-) X1.3
DOUT1_P: U$12.7(DOUT1+) X1.6
DOUT2_N: U$12.5(DOUT2-) X1.7
DOUT2_P: U$12.6(DOUT2+) X1.8
GND: C45.2 R18.1 R19.1 R20.2 R21.2 R22.2 R23.2 R26.2 U2.6(GND) U2.CD1(SHIELD) U2.CD2(SHIELD) U2.GND1(SHIELD) U2.GND3(SHIELD) U$12.9(!EN!) U$12.13(GND) X1.S@1(S1) X1.S@2(S2) ; also sheet 1,2,3,4
LED0: DBG0.A ; also sheet 3
LED1: DBG1.A ; also sheet 3
LED2: DBG2.A ; also sheet 3
LED3: DBG3.A ; also sheet 3
LNK_IN0: R18.2 U$12.14(ROUT2) ; also sheet 3
LNK_IN1: R19.2 U$12.15(ROUT1) ; also sheet 1
LNK_OUT0: U$12.11(DIN2) ; also sheet 3
LNK_OUT1: U$12.10(DIN1) ; also sheet 3
N$24: DBG3.C R23.1
N$25: DBG2.C R22.1
N$26: DBG1.C R21.1
N$27: DBG0.C R20.1
RIN1_N: U$12.1(RIN1-) X1.1
RIN1_P: U$12.2(RIN1+) X1.2
RIN2_N: U$12.4(RIN2-) X1.4
RIN2_P: U$12.3(RIN2+) X1.5
SDC_CLK: U2.5(SCK) ; also sheet 3
SDC_CMD: R24.1 U2.3(DI) ; also sheet 3
SDC_D0: R25.1 U2.7(DO) ; also sheet 3
SDC_D1: U2.8(RSV) ; also sheet 3
SDC_D2: U2.1(NC) ; also sheet 3
SDC_D3: R26.1 U2.2(CS) ; also sheet 3
VCCIO: C45.1 R24.2 R25.2 U2.4(VCC) U$12.12(VCC) U$12.16(EN) ; also sheet 2,3,4

### Buses
RIN1-,RIN1+,DOUT1-,DOUT1+,RIN2-,RIN2+,DOUT2-,DOUT2+
LED[0..3]

### Notes on the sheet
- Note that the bits are inverted for the
  link lines (in0:rout2, in1:rout1 etc.)
  so that the PCB can have no vias and
  straight line connections
- Other end of the link connects
  the corresponding outputs to the 
  input signals and vice versa.
- Resistors ensure link is grounded at
  boot time when no connection at
  other end of the line
- Ports can only drive 4mA, so 
  resistors set to 1K
- R24 and R25 placed because of notes in source code for SD card driver
  R26 placed so that port will work in SPI mode as a fallback
- LINK, LEDS, SD-Card

## Library data of the parts
BOOT_SW RESET_SW = SparkFun:TAC_SWITCH: Momentary Switch Button commonly used for reset or general input. Spark Fun Electronics SKU : COM-00097
C1-C26 C28 C31 C34-C46 = rcl:C-EU: CAPACITOR, European symbol
C27 C29 C30 C32 = rcl:CPOL-EU: POLARIZED CAPACITOR, European symbol
D1 = diode:DIODE-: DIODE
DBG0 DBG1-DBG3 LED1 = led:LED: LED OSRAM: - CHIPLED LG R971, LG N971, LY N971, LG Q971, LY Q971, LO R971, LY R971 LH N974, LH R974 LS Q976, LO Q976, LY Q976 LO Q996 - Hyper CHIPLED LW Q18S LB Q993, LB Q99A, LB R99A - SideLED LS A670, LO A670, LY A670, LG A670, LP A670 LB A673, LV A673, LT A673, LW A673 LH A674 LY A675 LS A676, LA A676, LO A676, LY A676, LW A676 LS A679, LY A679, LG A679 - Hyper Micro SIDELED® LS Y876, LA Y876, LO Y876, LY Y876 LT Y87S - SmartLED LW L88C, LW L88S LB L89C, LB L89S, LG L890 LS L89K, LO L89K, LY L89K LS L896, LA L896, LO L896, LY L896 - TOPLED LS T670, LO T670, LY T670, LG T670, LP T670 LSG T670, LSP T670, LSY T670, LOP T670, LYG T670 LG T671, LOG T671, LSG T671 LB T673, LV T673, LT T673, LW T673 LH T674 LS T676, LA T676, LO T676, LY T676, LB T676, LH T676, LSB T676, LW T676 LB T67C, LV T67C, LT T67C, LS T67K, LO T67K, LY T67K, LW E67C LS E67B, LA E67B, LO E67B, LY E67B, LB E67C, LV E67C, LT E67C LW T67C LS T679, LY T679, LG T679 LS T770, LO T770, LY T770, LG T770, LP T770 LB T773, LV T773, LT T773, LW T773 LH T774 LS E675, LA E675, LY E675, LS T675 LS T776, LA T776, LO T776, LY T776, LB T776 LHGB T686 LT T68C, LB T68C - Hyper Mini TOPLED® LB M676 - Mini TOPLED Santana® LG M470 LS M47K, LO M47K, LY M47K Source: http://www.osram.convergy.de LUXEON: - LUMILED® LXK2-PW12-R00, LXK2-PW12-S00, LXK2-PW14-U00, LXK2-PW14-V00 LXK2-PM12-R00, LXK2-PM12-S00, LXK2-PM14-U00 LXK2-PE12-Q00, LXK2-PE12-R00, LXK2-PE12-S00, LXK2-PE14-T00, LXK2-PE14-U00 LXK2-PB12-K00, LXK2-PB12-L00, LXK2-PB12-M00, LXK2-PB14-N00, LXK2-PB14-P00, LXK2-PB14-Q00 LXK2-PR12-L00, LXK2-PR12-M00, LXK2-PR14-Q00, LXK2-PR14-R00 LXK2-PD12-Q00, LXK2-PD12-R00, LXK2-PD12-S00 LXK2-PH12-R00, LXK2-PH12-S00 LXK2-PL12-P00, LXK2-PL12-Q00, LXK2-PL12-R00 Source: www.luxeon.com KINGBRIGHT: KA-3528ASYC Source: www.kingbright.com
IC1-IC5 = IDTQS_3245QG:IDTQS3245
L1 L2 = rcl:L-EU: INDUCTOR, European symbol
R1-R27 = rcl:R-EU_: RESISTOR, European symbol
SJ1 = SparkFun:SOLDERJUMPER: Solder Jumper Standard SMD solder jumper. Used to automate production. Two varients : Normally Open and Normally Closed are the same, but have different paste layers. NC will have a large amount of paste and should jumper during reflow.
U1 = SparkFun:OSCILLATOR
U2 = SparkFun-Connectors:USD-SOCKET: microSD Socket Push-push type uSD socket. Schematic element and footprint production proven. Spark Fun Electronics SKU : PRT-00127. tDoc lines correctly indicate media card edge positions when inserting (unlocked, locked, depressed).
U$1 = atari:ECL_CART
U$2 = Eagle_XMOS_Lib_COMPLETE:XL216-512-TQ128
U$3 = sjg-logic:74LVC1G07SE-7
U$4 U$5 = sjg-power:TPS561208DDCR
U$6 = sjg-power:TPS3808G33DBVR
U$7 = sjg-sdram:W9852G6KH
U$8 = sjg-logic:SN74LVC1G02
U$9 = sjg-logic:SN74CBTLV3257
U$10 = sjg-qspi:IS25LP080D-JNLE
U$11 = sjg-power:TPS3808G09DBVR
U$12 = sjg-isolation:FIN1049MTCX
USBPOWER = con-hirose:MINI-USB-: MINI USB Connector Source: http://www.hirose.co.jp/cataloge_hp/e24000019.pdf; OC_FARNELL: unknown; OC_NEWARK: unknown
X1 = con-molex:0446200002: RJ-45 INVERTED MODULAR JACK ASSEMBLY WITH RJ-11 KEEPOUT FEATURE Source: Data sheet <http://www.farnell.com/datasheets/73207.pdf> MOLEX 0446200002 BUCHSE, RJ45, GESCHIRMT Source: Farnell <http://de.farnell.com/molex/0446200002/buchse-rj45-geschirmt/dp/9251910?ost=9251910>; MF: MOLEX; MPN: 0446200002; OC_FARNELL: 9251910
XTAG = pinhead:PINHD-2X10: PIN HEADER

## Net classes
1 Power: width 0.305 mm, drill 0.203 mm, clearance 0.203 mm

## Board
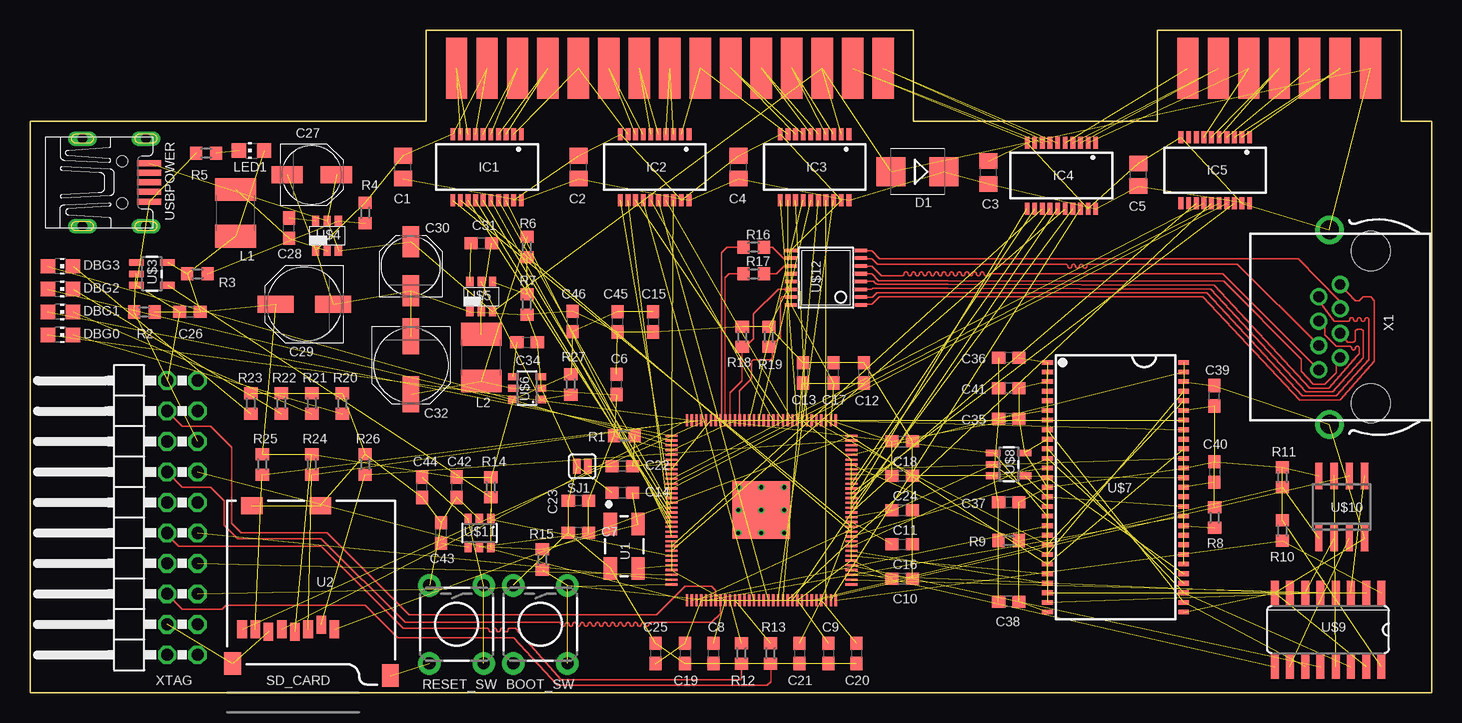
[diagram p5: board, top side]
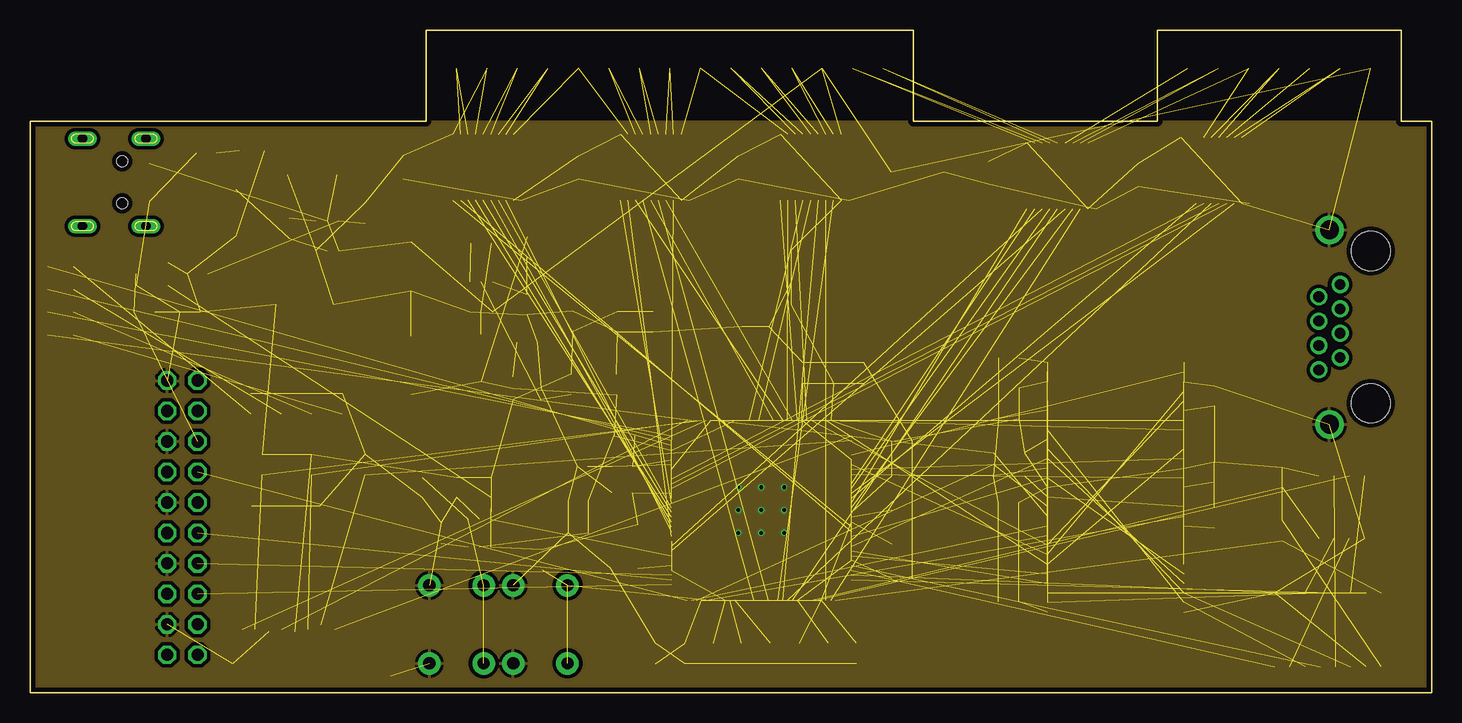
[diagram p6: board, inner layer Route2]
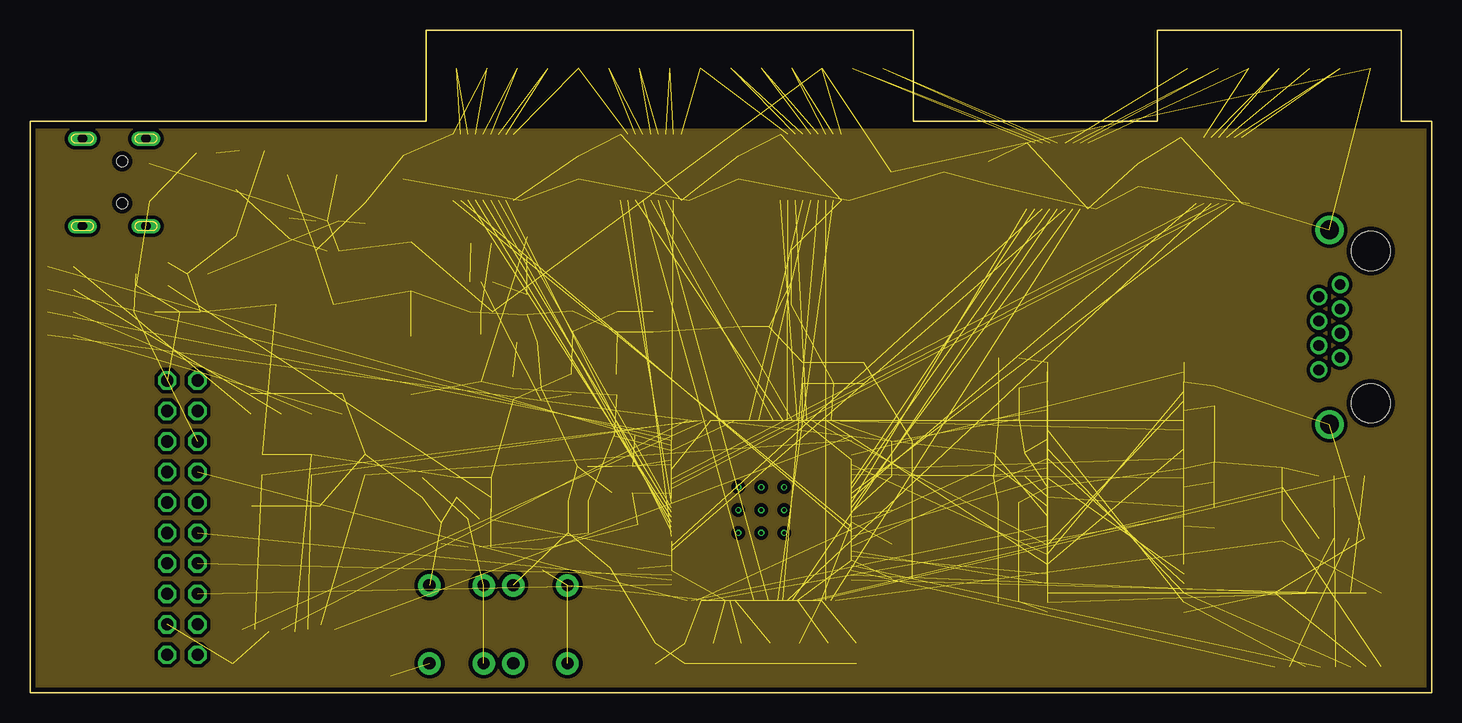
[diagram p7: board, inner layer Route15]
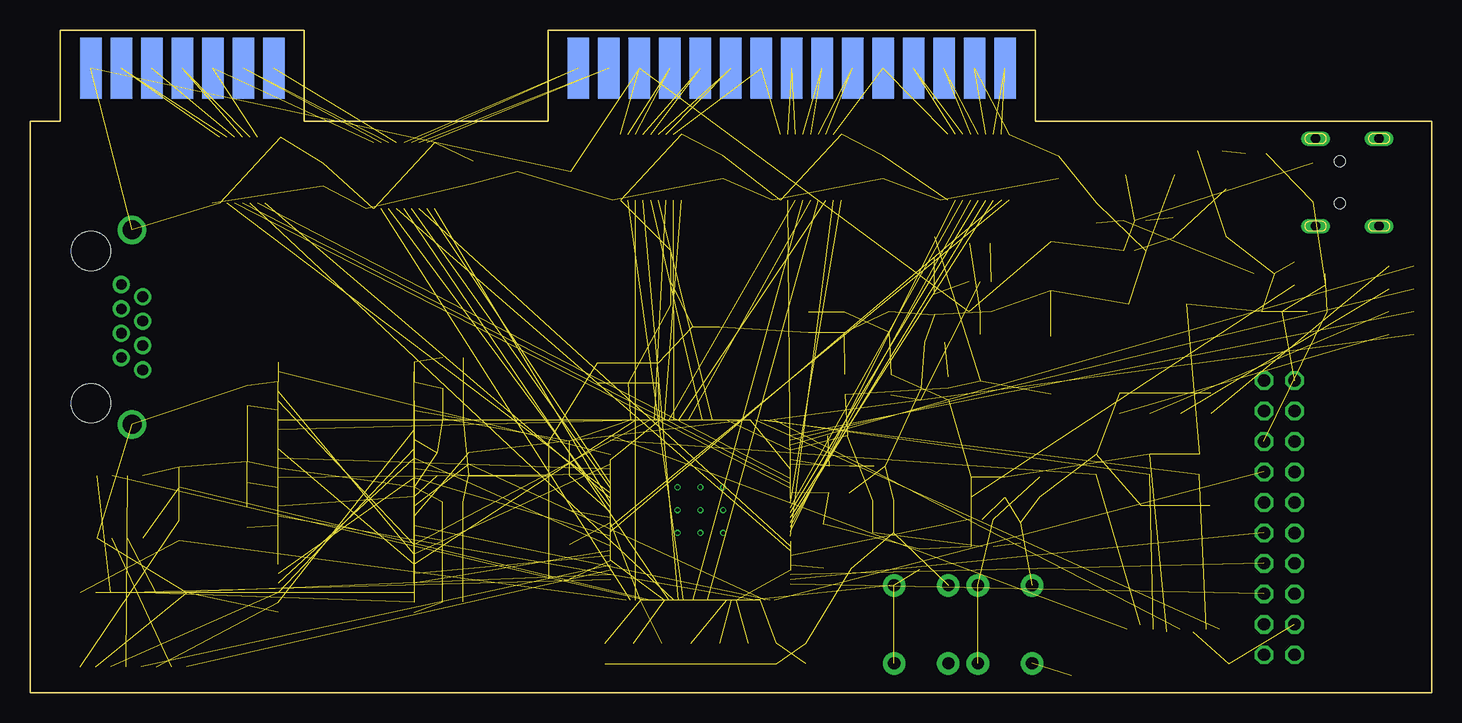
[diagram p8: board, bottom side, seen from below]

Size 116.84 x 55.24 mm. Coordinates in mm from the lower left corner, seen from the top.
Outline: 0,47.62 33.02,47.62 33.02,55.24 73.66,55.24 73.66,47.62 93.98,47.62 93.98,55.24 114.3,55.24 114.3,47.62 116.84,47.62 116.84,0 0,0 0,47.62
Copper layers (1*2*15*16): Top 0.035559375mm / dielectric 0.17018125mm / Route2 0.01778125mm / dielectric 47mil / Route15 0.01778125mm / dielectric 0.17018125mm / Bottom 0.035559375mm
Design rules "oshpark-4layer": minimum track width 5mil, minimum drill 10mil, track to track 5mil, track to pad 5mil, pad to pad 5mil, via to via 5mil, smd to smd 5mil, copper to edge 15mil, drill to drill 6mil, minimum pad ring 4mil, minimum via ring 4mil, stop-mask expansion 2.5mil, vias tented up to drill 0mil, thermal gap 10mil
vRestrict: area 54.3,21.9 to 67.6,23.5; area 67.6,8.6 to 69.2,21.6; area 54.3,7 to 67.6,8.6; area 52.7,8.6 to 54.3,21.9

### Footprints (pad centres in the part's own frame; a part is rotated, then mirrored left to right if it is on the bottom)
TACTILE-PTH = drill 1.016 pad 1.88: 1 -3.251,2.261; 2 3.251,2.261; 3 -3.251,-2.261; 4 3.251,-2.261
C0805 = smd 1.3 x 1.5: 1 -0.95,0; 2 0.95,0
C0603 = smd 1.1 x 1: 1 -0.85,0; 2 0.85,0
PANASONIC_C = smd 2.6 x 1.4: + 2.05,0; - -2.05,0
PANASONIC_D = smd 3 x 1.4: + 2.4,0; - -2.4,0
SMB = smd 2.4 x 2.4: A 2.2,0; C -2.2,0
CHIP-LED0805 = smd 1.2 x 1.2: A 0,-1.05; C 0,1.05
QSOP20 = smd 0.4 x 1: 1 -2.858,-2.75; 2 -2.223,-2.75; 3 -1.588,-2.75; 4 -0.953,-2.75; 5 -0.318,-2.75; 6 0.318,-2.75; 7 0.953,-2.75; 8 1.588,-2.75; 9 2.223,-2.75; 10 2.858,-2.75; 11 2.858,2.75; 12 2.223,2.75; 13 1.588,2.75; 14 0.953,2.75; 15 0.318,2.75; 16 -0.318,2.75; 17 -0.953,2.75; 18 -1.588,2.75; 19 -2.223,2.75; 20 -2.858,2.75
L1812 = smd 1.9 x 3.4: 1 -1.95,0; 2 1.95,0
R0603 = smd 1 x 1.1: 1 -0.85,0; 2 0.85,0
SJ_2S = smd 0.635 x 1.27: 1 -0.45,0; 2 0.45,0
CRYSTAL-OSC-SMD-5X3 = smd 1.9 x 1.1: 1 -1.85,-1.15; 2 1.85,-1.15; 3 1.85,1.15; 4 -1.85,1.15
MICRO-SD-SOCKET-PP = smd 0.8 x 1.5: 1 -8.94,10.7; 2 -7.84,10.3; 3 -6.74,10.7; 4 -5.64,10.9; 5 -4.54,10.7; 6 -3.44,10.9; 7 -2.34,10.7; 8 -1.24,10.7 | smd 1.8 x 1.4: CD1 -2.05,0.4; CD2 -7.75,0.4 | smd 1.4 x 1.9: GND1 -13.6,14.55; GND3 -0.45,13.55
ECL_CART = smd 1.778 x 5.08: P$1 2.54,4.445; P$2 5.08,4.445; P$3 7.62,4.445; P$4 10.16,4.445; P$5 12.7,4.445; P$6 15.24,4.445; P$7 17.78,4.445; P$8 20.32,4.445; P$9 22.86,4.445; P$10 25.4,4.445; P$11 27.94,4.445; P$12 30.48,4.445; P$13 33.02,4.445; P$14 35.56,4.445; P$15 38.1,4.445; P$38 63.5,4.445; P$39 66.04,4.445; P$40 68.58,4.445; P$41 71.12,4.445; P$42 73.66,4.445; P$43 76.2,4.445; P$44 78.74,4.445 | smd 1.778 x 5.08 bottom: P$16 2.54,4.445; P$17 5.08,4.445; P$18 7.62,4.445; P$19 10.16,4.445; P$20 12.7,4.445; P$21 15.24,4.445; P$22 17.78,4.445; P$23 20.32,4.445; P$24 22.86,4.445; P$25 25.4,4.445; P$26 27.94,4.445; P$27 30.48,4.445; P$28 33.02,4.445; P$29 35.56,4.445; P$30 38.1,4.445; P$31 63.5,4.445; P$32 66.04,4.445; P$33 68.58,4.445; P$34 71.12,4.445; P$35 73.66,4.445; P$36 76.2,4.445; P$37 78.74,4.445
TQFP128 = smd 1 x 0.18: 1 -7.5,6.2; 2 -7.5,5.8; 3 -7.5,5.4; 4 -7.5,5; 5 -7.5,4.6; 6 -7.5,4.2; 7 -7.5,3.8; 8 -7.5,3.4; 9 -7.5,3; 10 -7.5,2.6; 11 -7.5,2.2; 12 -7.5,1.8; 13 -7.5,1.4; 14 -7.5,1; 15 -7.5,0.6; 16 -7.5,0.2; 17 -7.5,-0.2; 18 -7.5,-0.6; 19 -7.5,-1; 20 -7.5,-1.4; 21 -7.5,-1.8; 22 -7.5,-2.2; 23 -7.5,-2.6; 24 -7.5,-3; 25 -7.5,-3.4; 26 -7.5,-3.8; 27 -7.5,-4.2; 28 -7.5,-4.6; 29 -7.5,-5; 30 -7.5,-5.4; 31 -7.5,-5.8; 32 -7.5,-6.2; 65 7.5,-6.2; 66 7.5,-5.8; 67 7.5,-5.4; 68 7.5,-5; 69 7.5,-4.6; 70 7.5,-4.2; 71 7.5,-3.8; 72 7.5,-3.4; 73 7.5,-3; 74 7.5,-2.6; 75 7.5,-2.2; 76 7.5,-1.8; 77 7.5,-1.4; 78 7.5,-1; 79 7.5,-0.6; 80 7.5,-0.2; 81 7.5,0.2; 82 7.5,0.6; 83 7.5,1; 84 7.5,1.4; 85 7.5,1.8; 86 7.5,2.2; 87 7.5,2.6; 88 7.5,3; 89 7.5,3.4; 90 7.5,3.8; 91 7.5,4.2; 92 7.5,4.6; 93 7.5,5; 94 7.5,5.4; 95 7.5,5.8; 96 7.5,6.2 | smd 0.18 x 1: 33 -6.2,-7.5; 34 -5.8,-7.5; 35 -5.4,-7.5; 36 -5,-7.5; 37 -4.6,-7.5; 38 -4.2,-7.5; 39 -3.8,-7.5; 40 -3.4,-7.5; 41 -3,-7.5; 42 -2.6,-7.5; 43 -2.2,-7.5; 44 -1.8,-7.5; 45 -1.4,-7.5; 46 -1,-7.5; 47 -0.6,-7.5; 48 -0.2,-7.5; 49 0.2,-7.5; 50 0.6,-7.5; 51 1,-7.5; 52 1.4,-7.5; 53 1.8,-7.5; 54 2.2,-7.5; 55 2.6,-7.5; 56 3,-7.5; 57 3.4,-7.5; 58 3.8,-7.5; 59 4.2,-7.5; 60 4.6,-7.5; 61 5,-7.5; 62 5.4,-7.5; 63 5.8,-7.5; 64 6.2,-7.5; 97 6.2,7.5; 98 5.8,7.5; 99 5.4,7.5; 100 5,7.5; 101 4.6,7.5; 102 4.2,7.5; 103 3.8,7.5; 104 3.4,7.5; 105 3,7.5; 106 2.6,7.5; 107 2.2,7.5; 108 1.8,7.5; 109 1.4,7.5; 110 1,7.5; 111 0.6,7.5; 112 0.2,7.5; 113 -0.2,7.5; 114 -0.6,7.5; 115 -1,7.5; 116 -1.4,7.5; 117 -1.8,7.5; 118 -2.2,7.5; 119 -2.6,7.5; 120 -3,7.5; 121 -3.4,7.5; 122 -3.8,7.5; 123 -4.2,7.5; 124 -4.6,7.5; 125 -5,7.5; 126 -5.4,7.5; 127 -5.8,7.5; 128 -6.2,7.5 | smd 4.8 x 4.8: PAD 0,0
SOT23-5 = smd 0.55 x 1.2: 1 -0.95,-1.3; 2 0,-1.3; 3 0.95,-1.3; 4 0.95,1.3; 5 -0.95,1.3
TSOT23-6_DDC = smd 0.6 x 0.8: 1 -0.95,-1.25; 2 0,-1.25; 3 0.95,-1.25; 4 0.95,1.25; 5 0,1.25; 6 -0.95,1.25
SOT23-6 = smd 0.6 x 0.9: 1 -0.95,-1.15; 2 0,-1.15; 3 0.95,-1.15; 4 0.95,1.15; 5 0,1.15; 6 -0.95,1.15
TSOP54-400 = smd 0.4 x 0.9: 1 -10.4,-5.68; 2 -9.6,-5.68; 3 -8.8,-5.68; 4 -8,-5.68; 5 -7.2,-5.68; 6 -6.4,-5.68; 7 -5.6,-5.68; 8 -4.8,-5.68; 9 -4,-5.68; 10 -3.2,-5.68; 11 -2.4,-5.68; 12 -1.6,-5.68; 13 -0.8,-5.68; 14 0,-5.68; 15 0.8,-5.68; 16 1.6,-5.68; 17 2.4,-5.68; 18 3.2,-5.68; 19 4,-5.68; 20 4.8,-5.68; 21 5.6,-5.68; 22 6.4,-5.68; 23 7.2,-5.68; 24 8,-5.68; 25 8.8,-5.68; 26 9.6,-5.68; 27 10.4,-5.68; 28 10.4,5.68; 29 9.6,5.68; 30 8.8,5.68; 31 8,5.68; 32 7.2,5.68; 33 6.4,5.68; 34 5.6,5.68; 35 4.8,5.68; 36 4,5.68; 37 3.2,5.68; 38 2.4,5.68; 39 1.6,5.68; 40 0.8,5.68; 41 0,5.68; 42 -0.8,5.68; 43 -1.6,5.68; 44 -2.4,5.68; 45 -3.2,5.68; 46 -4,5.68; 47 -4.8,5.68; 48 -5.6,5.68; 49 -6.4,5.68; 50 -7.2,5.68; 51 -8,5.68; 52 -8.8,5.68; 53 -9.6,5.68; 54 -10.4,5.68
SO16 = smd 0.66 x 2.032: 1 -4.445,-3.073; 2 -3.175,-3.073; 3 -1.905,-3.073; 4 -0.635,-3.073; 5 0.635,-3.073; 6 1.905,-3.073; 7 3.175,-3.073; 8 4.445,-3.073; 9 4.445,3.073; 10 3.175,3.073; 11 1.905,3.073; 12 0.635,3.073; 13 -0.635,3.073; 14 -1.905,3.073; 15 -3.175,3.073; 16 -4.445,3.073
SO-08 = smd 0.6 x 2.2: 1 -1.905,-2.6; 2 -0.635,-2.6; 3 0.635,-2.6; 4 1.905,-2.6; 5 1.905,2.6; 6 0.635,2.6; 7 -0.635,2.6; 8 -1.905,2.6
TSSOP16 = smd 0.305 x 0.991: 1 -2.275,-2.918; 2 -1.625,-2.918; 3 -0.975,-2.918; 4 -0.325,-2.918; 5 0.325,-2.918; 6 0.975,-2.918; 7 1.625,-2.918; 8 2.275,-2.918; 9 2.275,2.918; 10 1.625,2.918; 11 0.975,2.918; 12 0.325,2.918; 13 -0.325,2.918; 14 -0.975,2.918; 15 -1.625,2.918; 16 -2.275,2.918
UX60-MB-5S8 = smd 2 x 0.5: 1 8.65,1.6; 2 8.65,0.8; 3 8.65,0; 4 8.65,-0.8; 5 8.65,-1.6 | drill 0.8 long: M1 3.1,-3.65; M2 3.1,3.65; M3 8.4,3.65; M4 8.4,-3.65 | hole 0.9: 6.4,-1.75; 6.4,1.75
0446200002 = drill 0.889 pad 1.422: 1 3.556,2.54; 2 2.54,4.318; 3 1.524,2.54; 4 0.508,4.318; 5 -0.508,2.54; 6 -1.524,4.318; 7 -2.54,2.54; 8 -3.556,4.318 | drill 1.575 pad 2.286: S@1 -8.103,3.429; S@2 8.103,3.429 | hole 3.251: 6.35,0; -6.35,0
2X10/90 = drill 1.016 octagon: 1 -11.43,-6.35; 2 -11.43,-3.81; 3 -8.89,-6.35; 4 -8.89,-3.81; 5 -6.35,-6.35; 6 -6.35,-3.81; 7 -3.81,-6.35; 8 -3.81,-3.81; 9 -1.27,-6.35; 10 -1.27,-3.81; 11 1.27,-6.35; 12 1.27,-3.81; 13 3.81,-6.35; 14 3.81,-3.81; 15 6.35,-6.35; 16 6.35,-3.81; 17 8.89,-6.35; 18 8.89,-3.81; 19 11.43,-6.35; 20 11.43,-3.81

### Placement (x,y rotation side)
BOOT_SW  42.55,5.71 270 top
C1  100nF  [C0805]  31.11,43.81 90 top
C2  100nF  [C0805]  45.72,43.81 90 top
C3  100nF  [C0805]  79.88,43.37 90 top
C4  100nF  [C0805]  59.05,43.81 90 top
C5  100nF  [C0805]  92.39,43.18 90 top
C6  48.9,25.72 90 top
C7  45.72,13.34 180 top
C8  56.96,3.3 270 top
C9  66.55,3.3 270 top
C10  72.71,9.53 0 top
C11  72.71,15.24 0 top
C12  69.53,26.67 90 top
C13  64.45,26.67 90 top
C14  49.37,16.67 180 top
C15  51.94,30.92 270 top
C16  72.71,12.38 0 top
C17  66.99,26.67 90 top
C18  72.71,20.95 0 top
C19  54.61,3.3 270 top
C20  68.9,3.3 270 top
C21  64.14,3.3 270 top
C22  49.37,18.89 180 top
C23  45.72,16.03 180 top
C24  72.71,18.1 0 top
C25  52.13,3.3 270 top
C26  13.34,31.75 180 top
C27  23.5,43.18 0 top
C28  21.59,38.73 90 top
C29  22.86,32.38 180 top
C30  31.75,35.56 90 top
C31  37.62,37.47 180 top
C32  31.75,27.3 270 top
C34  41.43,29.21 0 top
C35  81.6,22.86 180 top
C36  81.6,27.94 180 top
C37  81.6,15.88 180 top
C38  81.6,7.62 180 top
C39  98.74,24.77 90 top
C40  98.74,18.41 270 top
C41  81.6,25.4 180 top
C42  35.56,17.14 270 top
C43  34.29,13.34 90 top
C44  32.7,17.14 90 top
C45  48.96,30.92 270 top
C46  45.24,30.96 90 top
D1  73.98,43.43 180 top
DBG0  2.54,29.84 270 top
DBG1  2.54,31.75 270 top
DBG2  2.54,33.66 270 top
DBG3  2.54,35.56 270 top
IC1  38.1,43.81 180 top
IC2  52.07,43.81 180 top
IC3  65.41,43.81 180 top
IC4  85.98,43.12 180 top
IC5  98.81,43.56 180 top
L1  17.14,40.01 90 top
L2  37.62,27.94 90 top
LED1  18.47,45.2 90 top
R1  49.53,21.43 180 top
R2  9.53,31.75 0 top
R3  13.97,34.92 180 top
R4  27.94,40.01 270 top
R5  14.69,44.98 0 top
R6  41.43,37.15 90 top
R7  41.43,32.38 90 top
R8  98.74,14.61 270 top
R9  81.6,12.7 0 top
R10  104.39,13.53 270 top
R11  104.39,17.97 270 top
R12  59.31,3.3 270 top
R13  61.72,3.3 270 top
R14  38.42,17.14 90 top
R15  42.7,11.11 90 top
R16  60.33,37.15 0 top
R17  60.33,34.92 0 top
R18  59.37,29.69 270 top
R19  61.59,29.69 270 top
R20  26.04,24.13 90 top
R21  23.5,24.13 90 top
R22  20.95,24.13 90 top
R23  18.41,24.13 90 top
R24  23.5,19.05 90 top
R25  19.37,19.05 90 top
R26  27.94,19.05 90 top
R27  45.09,25.72 90 top
RESET_SW  35.56,5.71 270 top
SJ1  46.04,18.89 0 top
U1  49.53,12.22 270 top
U2  16.45,16 180 top
U$1  33.02,47.62 0 top
U$2  60.96,15.24 90 top
U$3  10.16,34.92 270 top
U$4  24.77,38.1 0 top
U$5  37.62,33.02 0 top
U$6  41.43,25.4 90 top
U$7  90.49,17.14 270 top
U$8  81.6,19.05 270 top
U$9  108.2,5.27 180 top
U$10  109.35,15.49 0 top
U$11  37.47,13.34 180 top
U$12  66.36,34.61 90 top
USBPOWER  1.27,42.55 0 top
X1  111.76,30.48 90 top
XTAG  7.62,14.61 90 top

### Tracks (layer width: path | path; a pad name or v marks a point on that pad's centre or on a via)
!QSPI_CS!  (2 unrouted)
!RESET!  (4 unrouted)
!SD_CAS!  (2 unrouted)
!SD_ENABLE!  (2 unrouted)
!SD_RAS!  (1 unrouted)
!SD_WE!  (2 unrouted)
!X_CCTL!  (1 unrouted)
!X_D1XX!  (1 unrouted)
!X_EXSEL!  (1 unrouted)
!X_HALT!  (1 unrouted)
!X_IRQ!  (1 unrouted)
!X_MPD!  (1 unrouted)
!X_REF!  (1 unrouted)
!X_RST!  (1 unrouted)
!X_S4!  (1 unrouted)
!X_S5!  (1 unrouted)
+4.3V  (10 unrouted)
+5V  (8 unrouted)
B1  (1 unrouted)
B2  (1 unrouted)
B3  (1 unrouted)
B4  (1 unrouted)
B5  (1 unrouted)
B6  (1 unrouted)
B7  (1 unrouted)
B8  (1 unrouted)
B9  (1 unrouted)
B10  (1 unrouted)
B11  (1 unrouted)
B12  (1 unrouted)
B13  (1 unrouted)
B14  (1 unrouted)
B15  (1 unrouted)
B16  (1 unrouted)
B17  (1 unrouted)
B18  (1 unrouted)
B19  (1 unrouted)
B20  (1 unrouted)
B21  (1 unrouted)
B22  (1 unrouted)
B23  (1 unrouted)
B24  (1 unrouted)
B25  (1 unrouted)
B26  (1 unrouted)
B27  (1 unrouted)
B28  (1 unrouted)
B29  (1 unrouted)
B30  (1 unrouted)
B31  (1 unrouted)
B32  (1 unrouted)
B33  (1 unrouted)
B34  (1 unrouted)
B35  (1 unrouted)
B36  (1 unrouted)
B37  (1 unrouted)
B38  (1 unrouted)
DOUT1_N
  Top 0.127: X1.3 109.16,32.07 109.16,32.7 105.73,36.2 70.8,36.2 70.17,36.83 69.33,36.83 U$12.8
DOUT1_P
  Top 0.127: X1.6 100.65,35.72 88.27,35.72 arc90 88.11,35.56 arc-90 87.95,35.4 arc-90 87.79,35.56 arc90 87.63,35.72 arc90 87.47,35.56 arc-90 87.31,35.4 arc-90 87.15,35.56 arc90 87,35.72 arc90 86.84,35.56 arc-90 86.68,35.4 arc-90 86.52,35.56 arc90 86.36,35.72 70.64,35.72 70.17,36.2 69.31,36.2 U$12.7
DOUT2_N
  Top 0.127: X1.7 108.9,27.62 108.9,26.67 107.95,25.72 107,25.72 105.98,26.8 105.98,27.81 99.5,34.29 76.52,34.37 70.72,34.37 70.17,34.92 U$12.5
DOUT2_P
  Top 0.127: X1.8 99.44,34.92 79.85,34.92 arc-90 79.69,34.77 arc-90 79.53,34.92 arc90 79.38,35.08 arc90 79.22,34.92 arc-90 79.06,34.77 arc-90 78.9,34.92 arc90 78.74,35.08 arc90 78.58,34.92 arc-90 78.42,34.77 arc-90 78.26,34.92 arc90 78.11,35.08 arc90 77.95,34.92 arc-90 77.79,34.77 arc-90 77.63,34.92 arc90 77.47,35.08 arc90 77.31,34.92 arc-90 77.15,34.77 arc-90 76.99,34.92 arc90 76.83,35.08 arc90 76.68,34.92 arc-90 76.52,34.77 arc-90 76.36,34.92 arc90 76.2,35.08 arc90 76.04,34.92 arc-90 75.88,34.77 arc-90 75.72,34.92 arc90 75.56,35.08 arc90 75.41,34.92 arc-90 75.25,34.77 arc-90 75.09,34.92 arc90 74.93,35.08 arc90 74.77,34.92 arc-90 74.61,34.77 arc-90 74.45,34.92 arc90 74.3,35.08 arc90 74.14,34.92 arc-90 73.98,34.77 arc-90 73.82,34.92 arc90 73.66,35.08 arc90 73.5,34.92 arc-90 73.34,34.77 arc-90 73.18,34.92 arc90 73.03,35.08 arc90 72.87,34.92 arc-90 72.71,34.77 arc-5 71.28,34.77 70.96,34.77 70.17,35.56 69.3,35.56 U$12.6
EN_1V0  (2 unrouted)
GND  (via drill 0.3)  (91 unrouted)
  other vias: 60.96,15.24 59.05,15.24 59.05,17.14 60.96,17.14 62.87,17.14 62.87,15.24 62.87,13.34 60.96,13.34 59.05,13.34
  pour Route2 (isolate 0.305): 0,47.62 116.84,47.62 116.84,0 0,0
JTAG_DN0
  Top 0.127: XTAG.14 12.7,17.14 15.08,17.14 16.19,16.03 16.19,13.97 17.3,12.86 24.29,12.86 31.27,5.87 43.66,5.87 44.13,5.87 arc-90 44.29,5.71 arc90 44.45,5.56 arc90 44.61,5.71 arc-90 44.77,5.87 arc-90 44.93,5.71 arc90 45.09,5.56 arc90 45.24,5.71 arc-90 45.4,5.87 arc-90 45.56,5.71 arc90 45.72,5.56 arc90 45.88,5.71 arc-90 46.04,5.87 arc-90 46.2,5.71 arc90 46.35,5.56 arc90 46.51,5.71 arc-90 46.67,5.87 arc-90 46.83,5.71 arc90 46.99,5.56 arc90 47.15,5.71 arc-90 47.31,5.87 arc-90 47.47,5.71 arc90 47.62,5.56 arc90 47.78,5.71 arc-90 47.94,5.87 arc-90 48.1,5.71 arc90 48.26,5.56 arc90 48.42,5.71 arc-90 48.58,5.87 arc-90 48.74,5.71 arc90 48.9,5.56 arc90 49.05,5.71 arc-90 49.21,5.87 arc-90 49.37,5.71 arc90 49.53,5.56 arc90 49.69,5.71 arc-90 49.85,5.87 arc-90 50.01,5.71 arc90 50.16,5.56 arc90 50.32,5.71 arc-90 50.48,5.87 arc-90 50.64,5.71 arc90 50.8,5.56 arc90 50.96,5.71 arc-90 51.12,5.87 arc-90 51.28,5.71 arc90 51.44,5.56 arc90 51.59,5.71 arc-90 51.75,5.87 56.83,5.87 57.56,6.6 U$2.8
JTAG_DN1
  Top 0.127: XTAG.18 12.7,22.23 15.08,22.23 16.83,20.48 16.83,14.13 17.62,13.34 24.77,13.34 31.59,6.51 52.23,6.51 54.61,8.89 56.83,8.89 57.15,8.57 U$2.7
JTAG_UP0
  Top 0.127: R12.2 59.31,1.33 59.37,1.27 59.21,1.11 44.29,1.11 40.48,5.4 40.01,5.4 arc90 39.85,5.24 arc-90 39.69,5.08 arc-90 39.53,5.24 arc90 39.37,5.4 arc90 39.21,5.24 arc-90 39.05,5.08 arc-90 38.89,5.24 arc90 38.73,5.4 arc90 38.58,5.24 arc-90 38.42,5.08 arc-90 38.26,5.24 arc90 38.1,5.4 31.11,5.4 24.29,12.22 12.38,12.22 11.43,13.18 XTAG.10
JTAG_UP1
  Top 0.127: XTAG.6 12.7,6.99 16.03,6.99 16.35,7.3 27.94,7.3 30.64,4.6 40.32,4.6 43.97,0.64 61.44,0.64 61.75,0.95 61.75,2.42 R13.2
LED0  (1 unrouted)
LED1  (1 unrouted)
LED2  (1 unrouted)
LED3  (1 unrouted)
LNK_IN0
  Top 0.127: U$2.87 58.36,25.02 59.37,26.04 R18.2 59.63,28.84 60.33,29.53 60.33,31.59 62.39,33.66 63.42,33.66 U$12.14
LNK_IN1
  Top 0.127: U$2.85 59.16,25.19 60.17,26.19 60.17,27.62 60.33,27.78 61.75,27.78 61.91,27.94 61.91,28.42 R19.2 61.7,28.84 62.55,29.69 62.55,32.86 62.71,33.02 63.4,33.02 U$12.15
LNK_OUT0
  Top 0.127: R17.2 62.23,34.92 62.87,35.56 63.42,35.56 U$12.11
LNK_OUT1
  Top 0.127: R16.2 61.91,37.15 62.87,36.2 63.4,36.2 U$12.10
N$1  (2 unrouted)
N$2  (1 unrouted)
N$3  (2 unrouted)
N$4  (1 unrouted)
N$5  (2 unrouted)
N$6  (1 unrouted)
N$7  (2 unrouted)
N$8  (1 unrouted)
N$9  (2 unrouted)
N$10  (1 unrouted)
N$11  (2 unrouted)
N$12  (2 unrouted)
N$13  (1 unrouted)
N$14  (2 unrouted)
N$15  (1 unrouted)
N$16  (1 unrouted)
N$17  (1 unrouted)
N$18  (1 unrouted)
N$19  (1 unrouted)
N$20  (1 unrouted)
N$21  (3 unrouted)
N$22  (1 unrouted)
N$23  (1 unrouted)
N$24  (1 unrouted)
N$25  (1 unrouted)
N$26  (1 unrouted)
N$27  (1 unrouted)
N$28
  Top 0.127: U$2.88 57.94,22.74 57.94,34.61 58.26,34.92 R17.1
N$29
  Top 0.127: U$2.89 57.63,22.81 57.63,36.67 58.1,37.15 R16.1
N$33  (3 unrouted)
QSPI_CLK  (1 unrouted)
RIN1_N
  Top 0.127: X1.1 110.49,32.7 110.81,32.7 111.12,33.02 111.76,33.02 112.08,32.7 112.08,27.62 109.22,24.45 105.86,24.38 97.79,33.02 70.8,33.02 70.17,32.38 69.33,32.38 U$12.1
RIN1_P
  Top 0.127: X1.2 107.44,32.7 108.74,30.96 109.86,30.96 arc90 110.01,31.11 arc-90 110.17,31.27 arc-90 110.33,31.11 arc90 110.49,30.96 arc90 110.65,31.11 arc-90 110.81,31.27 arc-90 110.97,31.11 arc90 111.12,30.96 arc90 111.28,31.11 arc-90 111.44,31.27 arc-90 111.6,31.11 111.6,27.78 108.9,24.77 106.05,24.77 98.11,33.34 70.59,33.34 70.22,32.97 U$12.2
RIN2_N
  Top 0.127: U$12.4 70.33,34.29 70.54,34.08 70.59,34.08 70.62,34.05 76.52,34.05 98.74,33.97 106.68,25.4 108.27,25.4 110.65,28.1 arc-7 110.81,28.26 110.81,28.73 arc90 110.65,28.89 arc90 110.49,28.73 arc-90 110.33,28.57 arc-90 110.17,28.73 arc90 110.01,28.89 108.9,28.89 107.95,29.84 107.95,30.48 X1.4
RIN2_P
  Top 0.127: X1.5 109.86,29.21 110.33,29.21 110.49,29.37 110.49,30.16 110.65,30.32 110.97,30.32 111.12,30.16 111.12,27.94 108.58,25.08 106.36,25.08 98.42,33.66 76.52,33.73 70.25,33.73 70.17,33.66 69.3,33.66 U$12.3
SD_ADQ0  (2 unrouted)
SD_ADQ1  (2 unrouted)
SD_ADQ2  (2 unrouted)
SD_ADQ2/QS_D0  (1 unrouted)
SD_ADQ3  (2 unrouted)
SD_ADQ3/QS_D1  (1 unrouted)
SD_ADQ4  (2 unrouted)
SD_ADQ4/QS_D2  (1 unrouted)
SD_ADQ5  (2 unrouted)
SD_ADQ5/QS_D3  (1 unrouted)
SD_ADQ6  (2 unrouted)
SD_ADQ7  (2 unrouted)
SD_ADQ8  (2 unrouted)
SD_ADQ9  (2 unrouted)
SD_ADQ10  (2 unrouted)
SD_ADQ11  (2 unrouted)
SD_ADQ12  (2 unrouted)
SD_ADQ13  (2 unrouted)
SD_ADQ14  (2 unrouted)
SD_ADQ15  (1 unrouted)
SD_CLK  (1 unrouted)
SDC_CLK  (1 unrouted)
SDC_CMD  (2 unrouted)
SDC_D0  (2 unrouted)
SDC_D1  (1 unrouted)
SDC_D2  (1 unrouted)
SDC_D3  (2 unrouted)
TCK  (1 unrouted)
TDI  (1 unrouted)
TDO  (1 unrouted)
TMS  (1 unrouted)
VCCINT  (31 unrouted)
VCCIO  (63 unrouted)
  pour Route15 (isolate 0.305): 0,46.99 116.84,46.99 116.84,0 0,0
X_A0  (1 unrouted)
X_A1  (1 unrouted)
X_A2  (1 unrouted)
X_A3  (1 unrouted)
X_A4  (1 unrouted)
X_A5  (1 unrouted)
X_A6  (1 unrouted)
X_A7  (1 unrouted)
X_A8  (1 unrouted)
X_A9  (1 unrouted)
X_A10  (1 unrouted)
X_A11  (1 unrouted)
X_A12  (1 unrouted)
X_A13  (1 unrouted)
X_A14  (1 unrouted)
X_A15  (1 unrouted)
X_B02  (1 unrouted)
X_D0  (1 unrouted)
X_D1  (1 unrouted)
X_D2  (1 unrouted)
X_D3  (1 unrouted)
X_D4  (1 unrouted)
X_D5  (1 unrouted)
X_D6  (1 unrouted)
X_D7  (1 unrouted)
X_R/!W!  (1 unrouted)
X_RD4  (1 unrouted)
X_RD5  (1 unrouted)

### Text on the board
tPlace: SD_CARD